# Altium project Module_FPGA_FreqDivider4Layers.PrjPcb
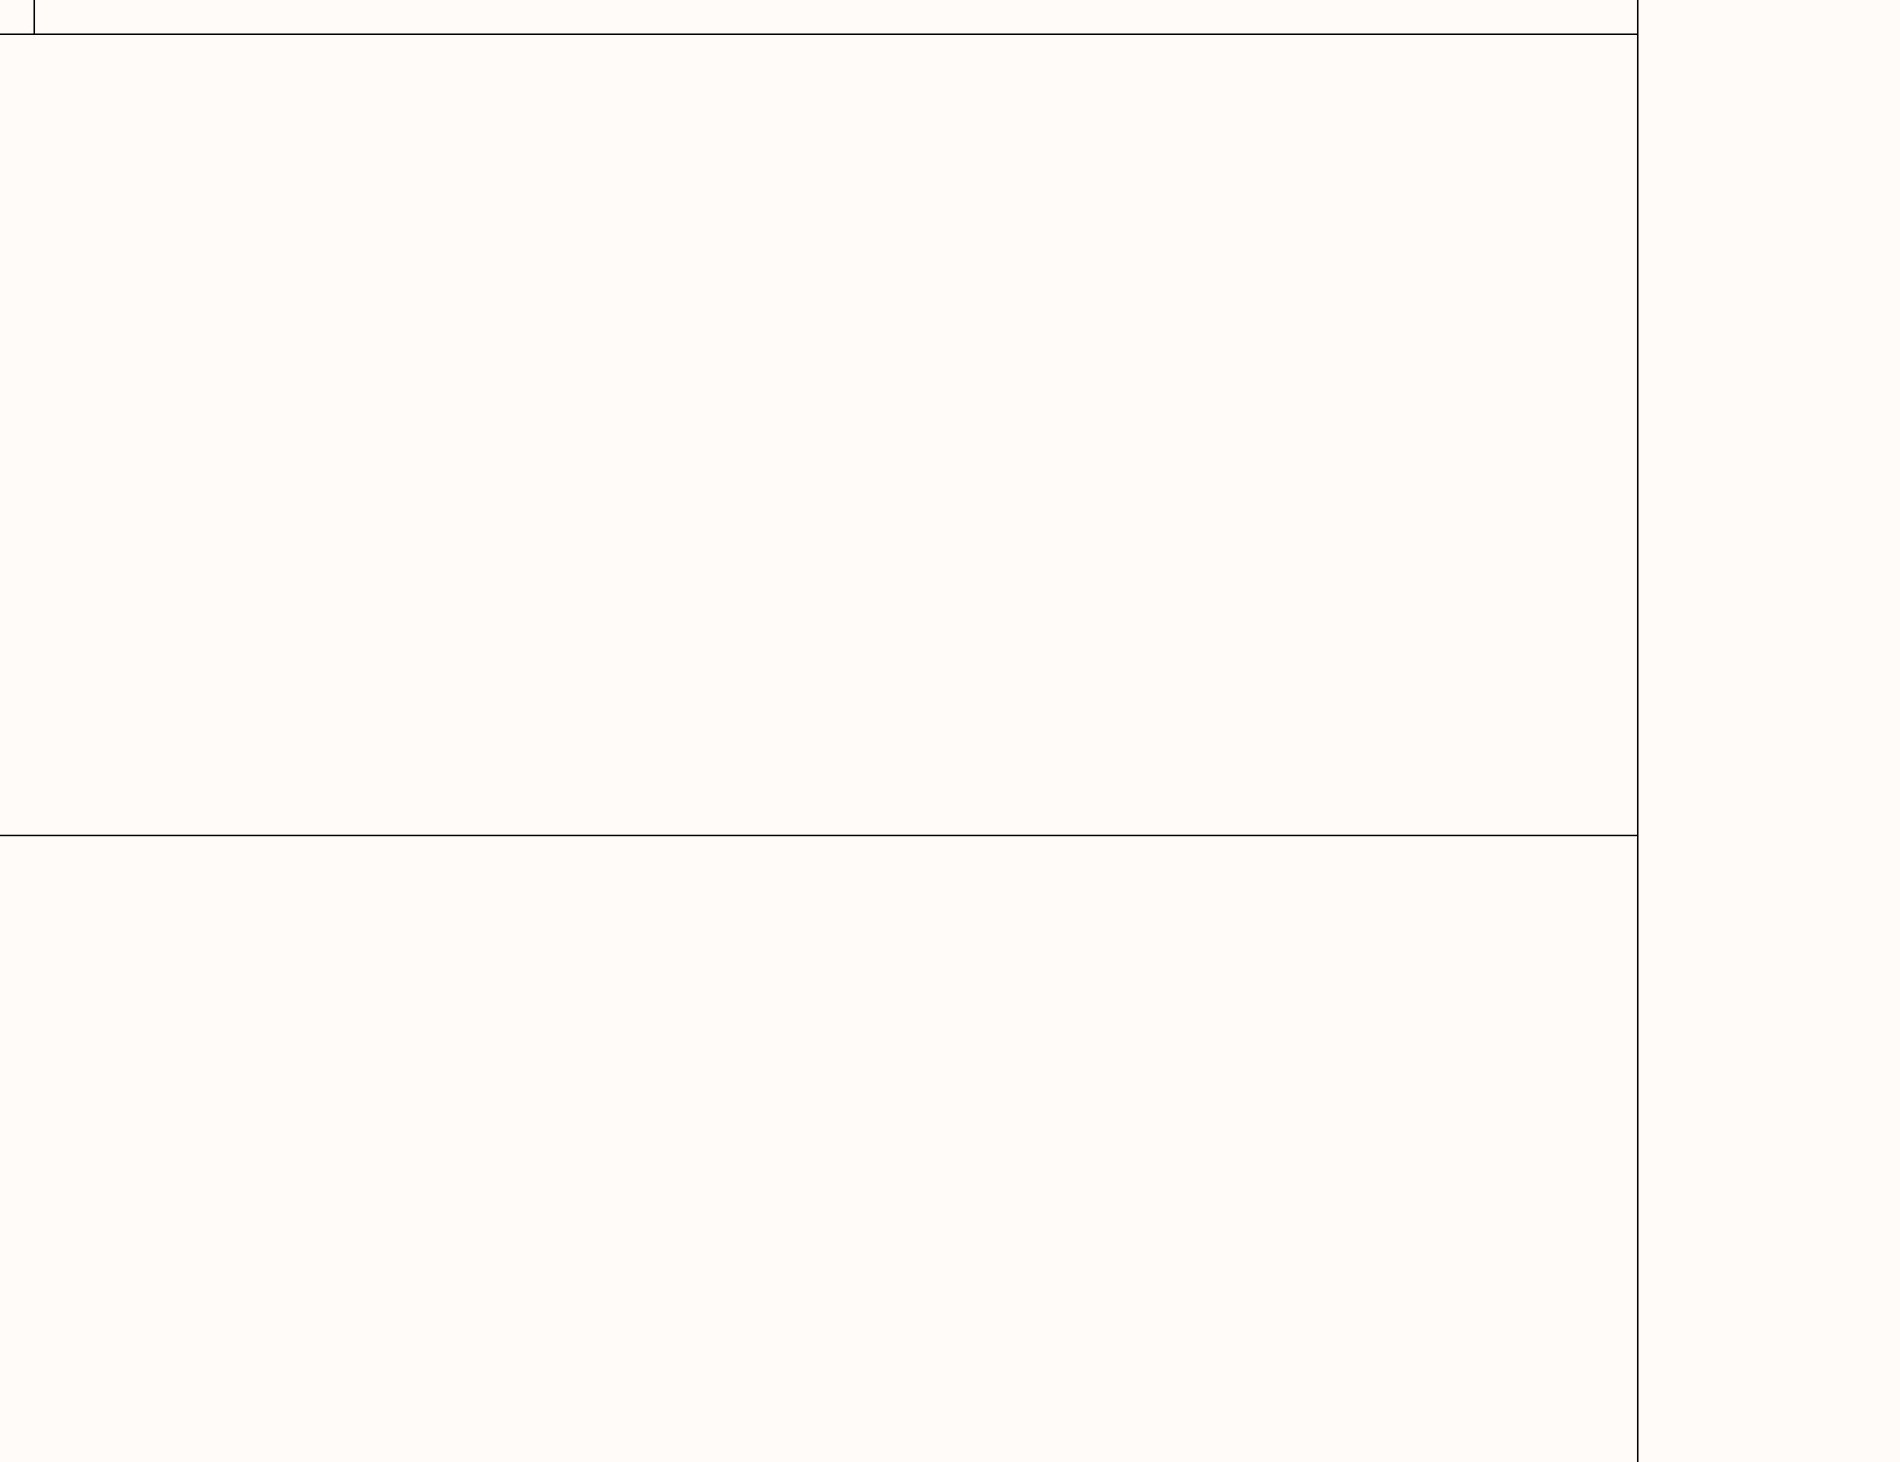
[diagram p0: Synthesizer.SchDoc, top column 1 of 4]
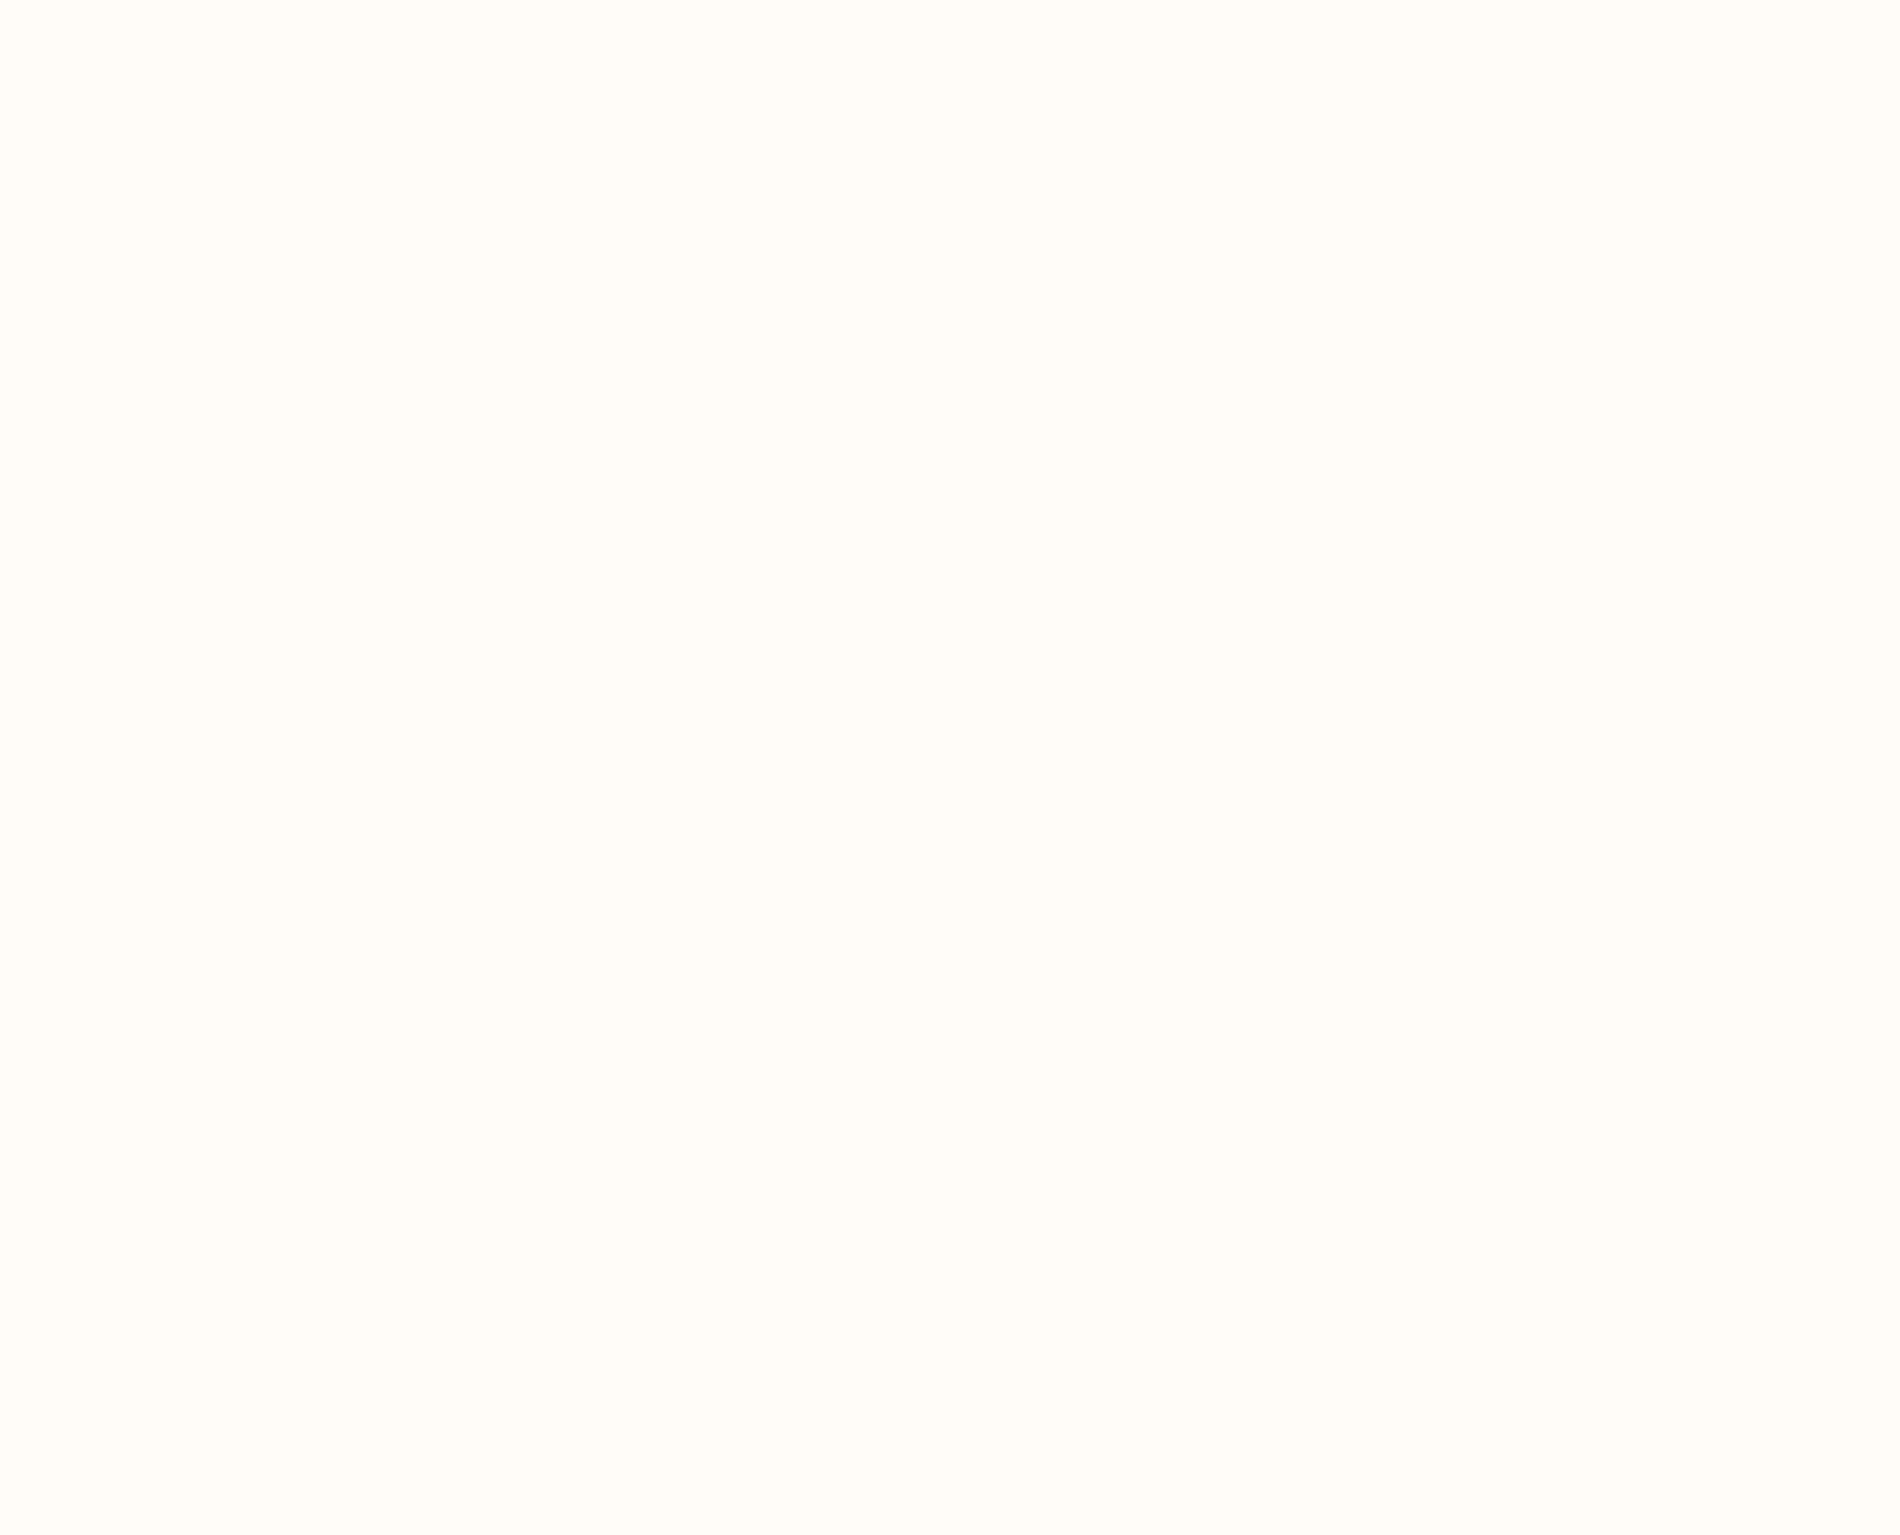
[diagram p1: Synthesizer.SchDoc, top column 2 of 4]
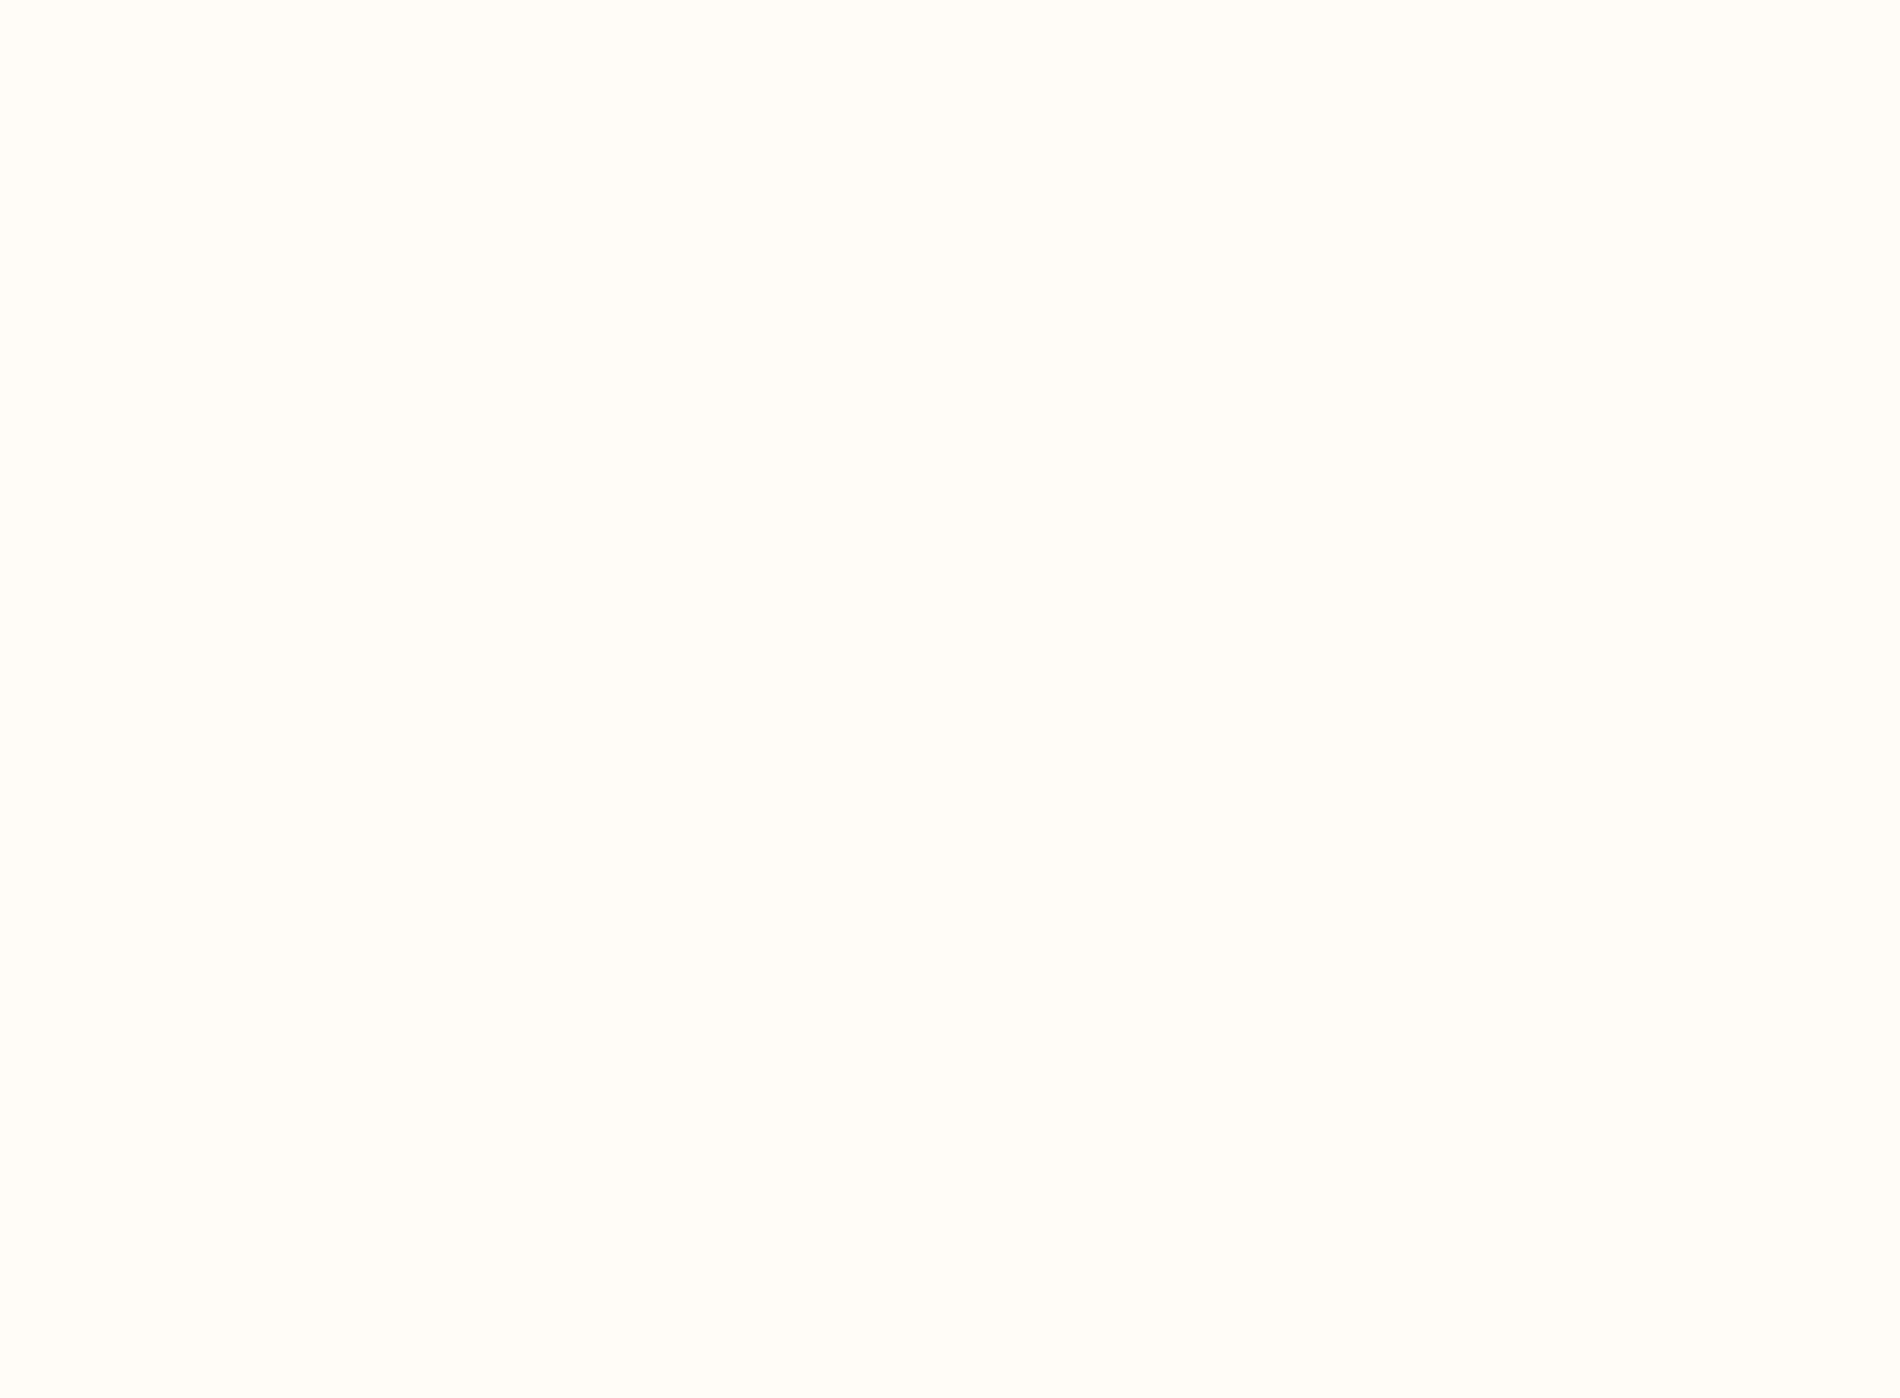
[diagram p2: Synthesizer.SchDoc, top column 3 of 4]
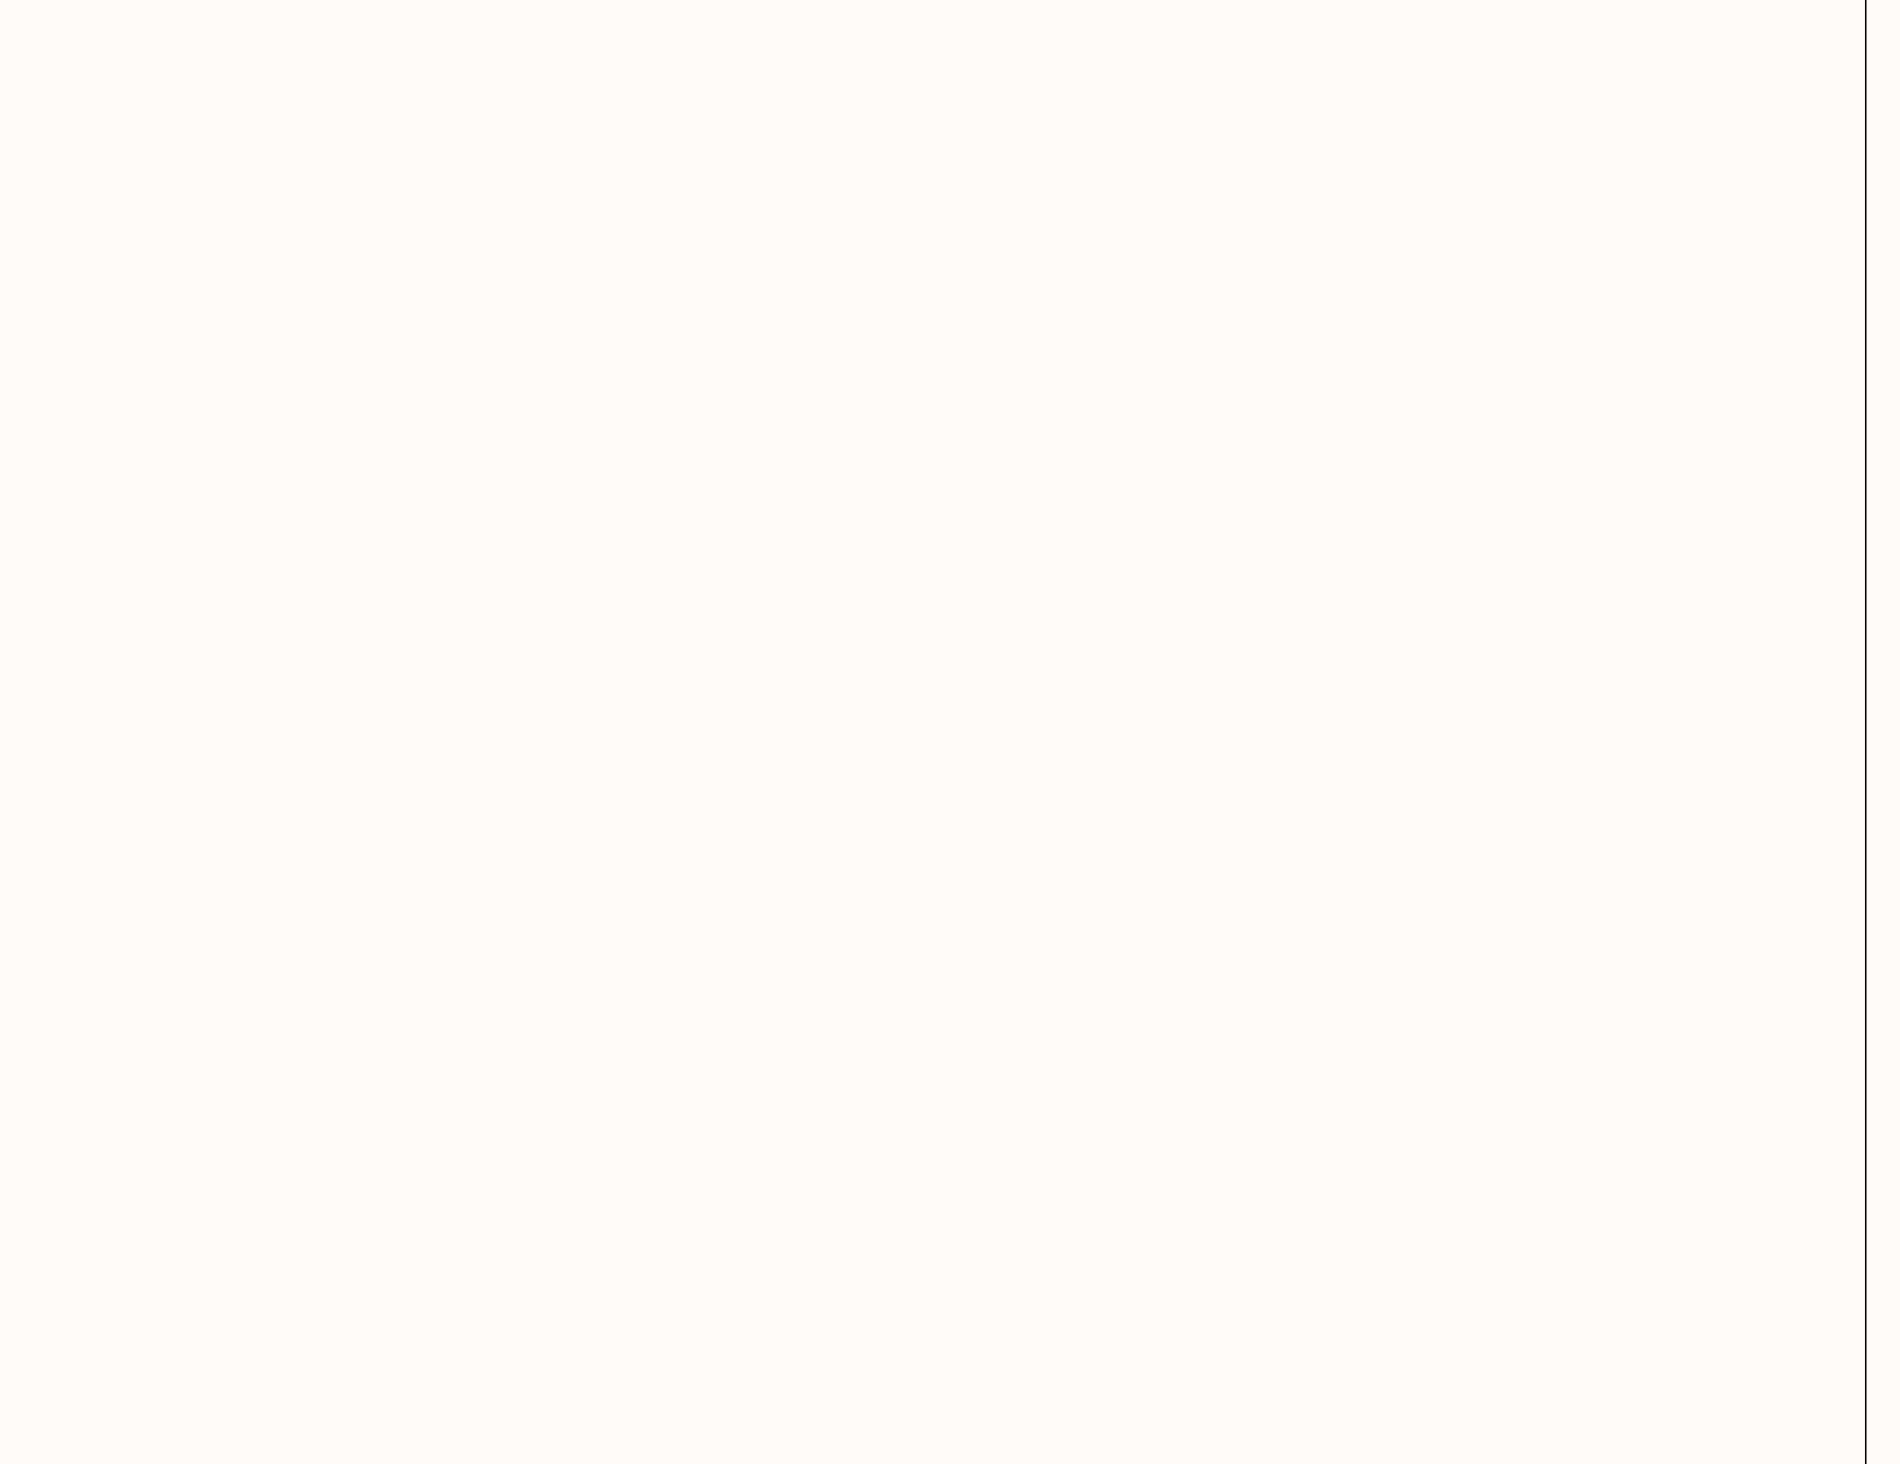
[diagram p3: Synthesizer.SchDoc, top column 4 of 4]
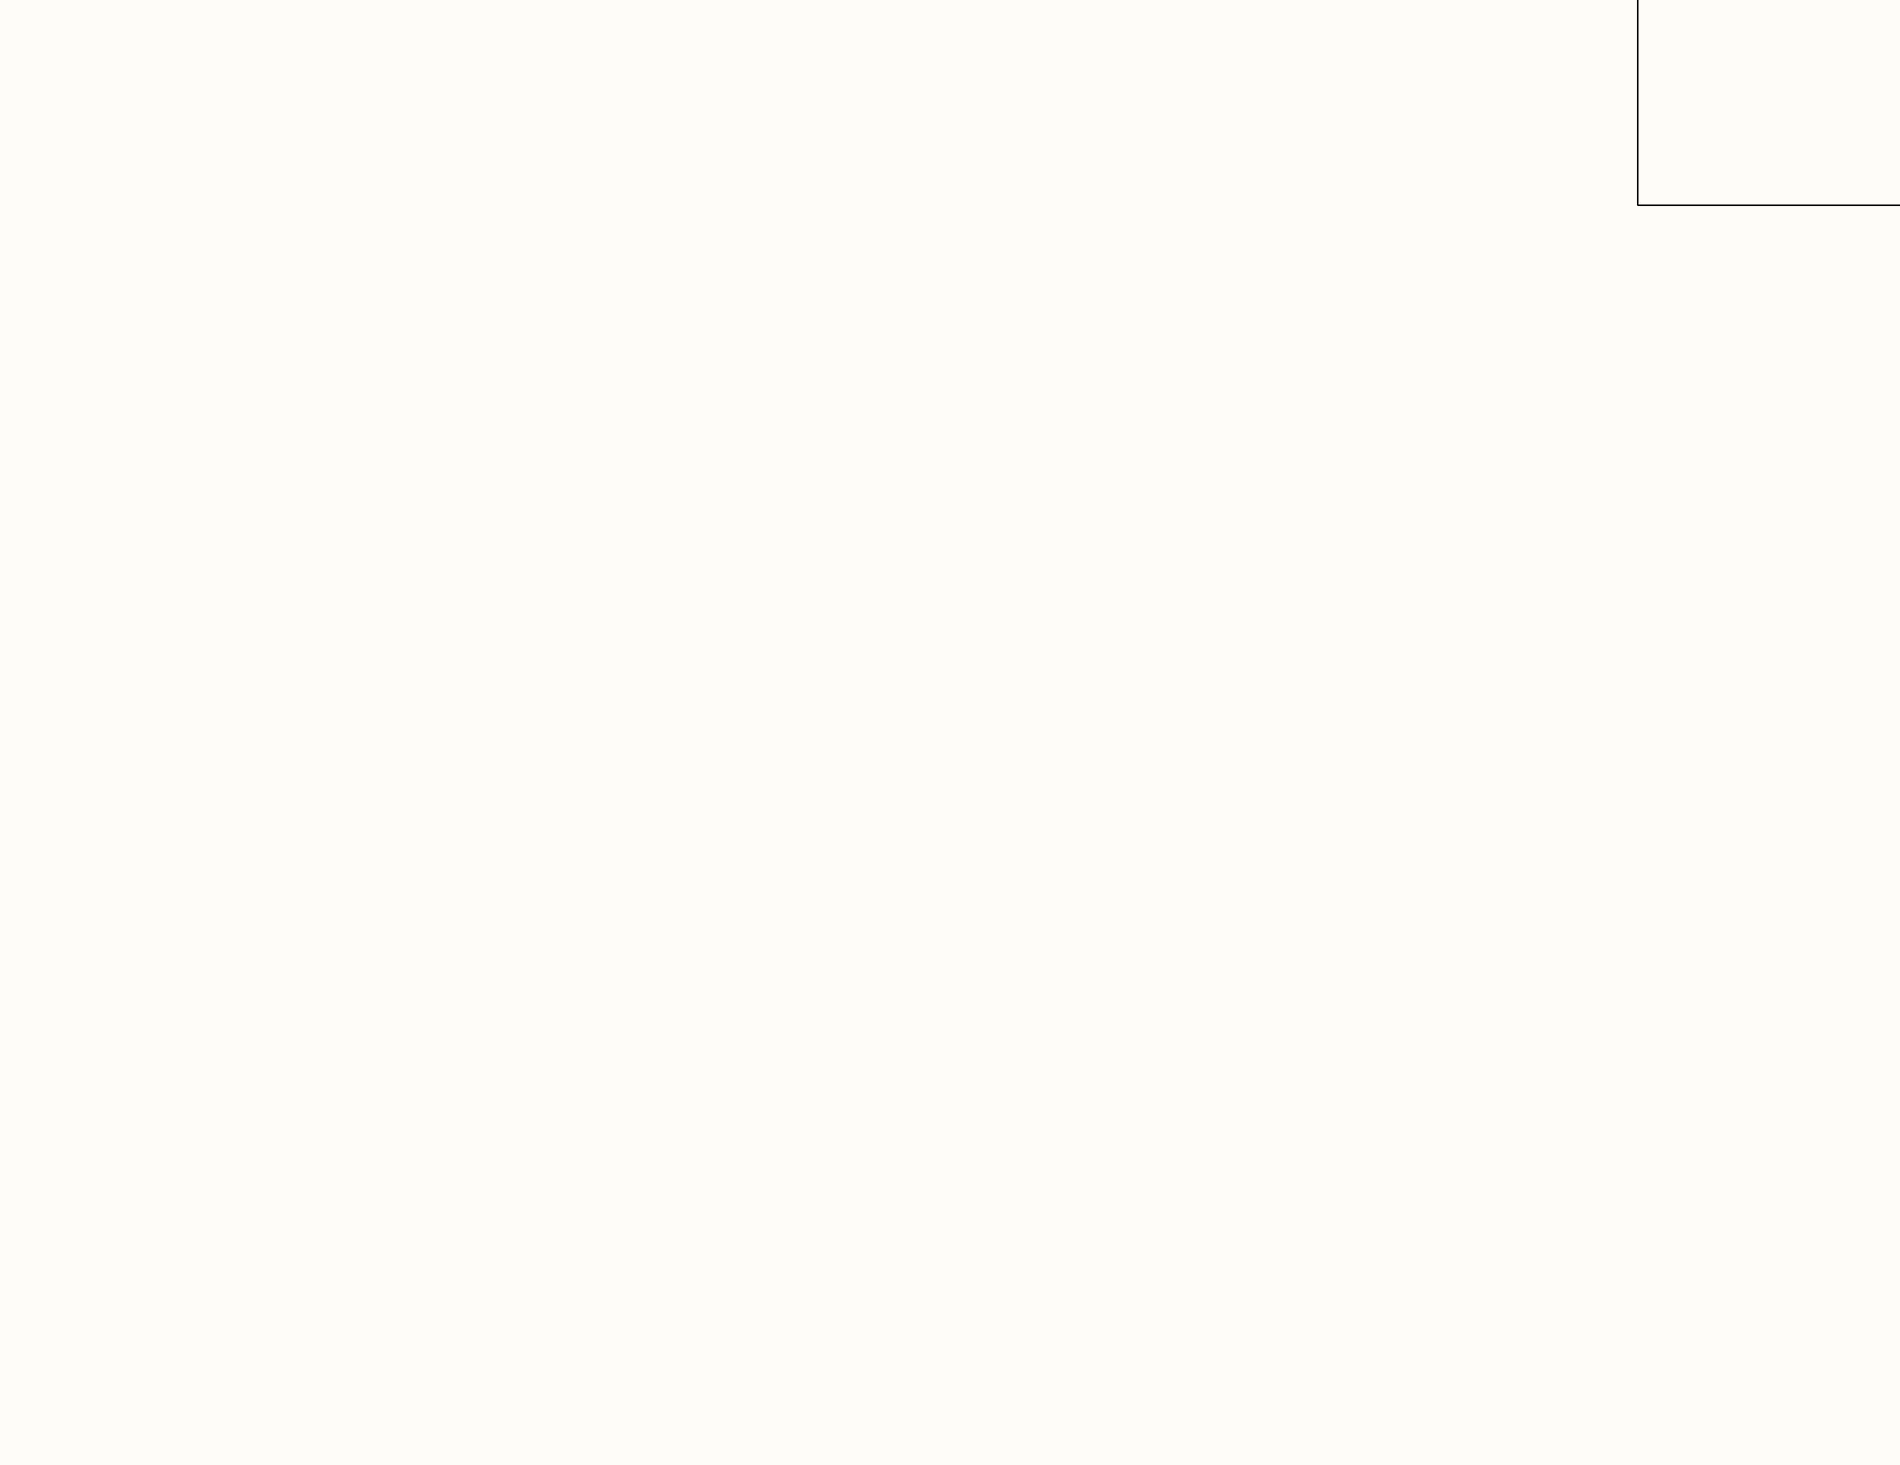
[diagram p4: Synthesizer.SchDoc, centre column 1 of 4]
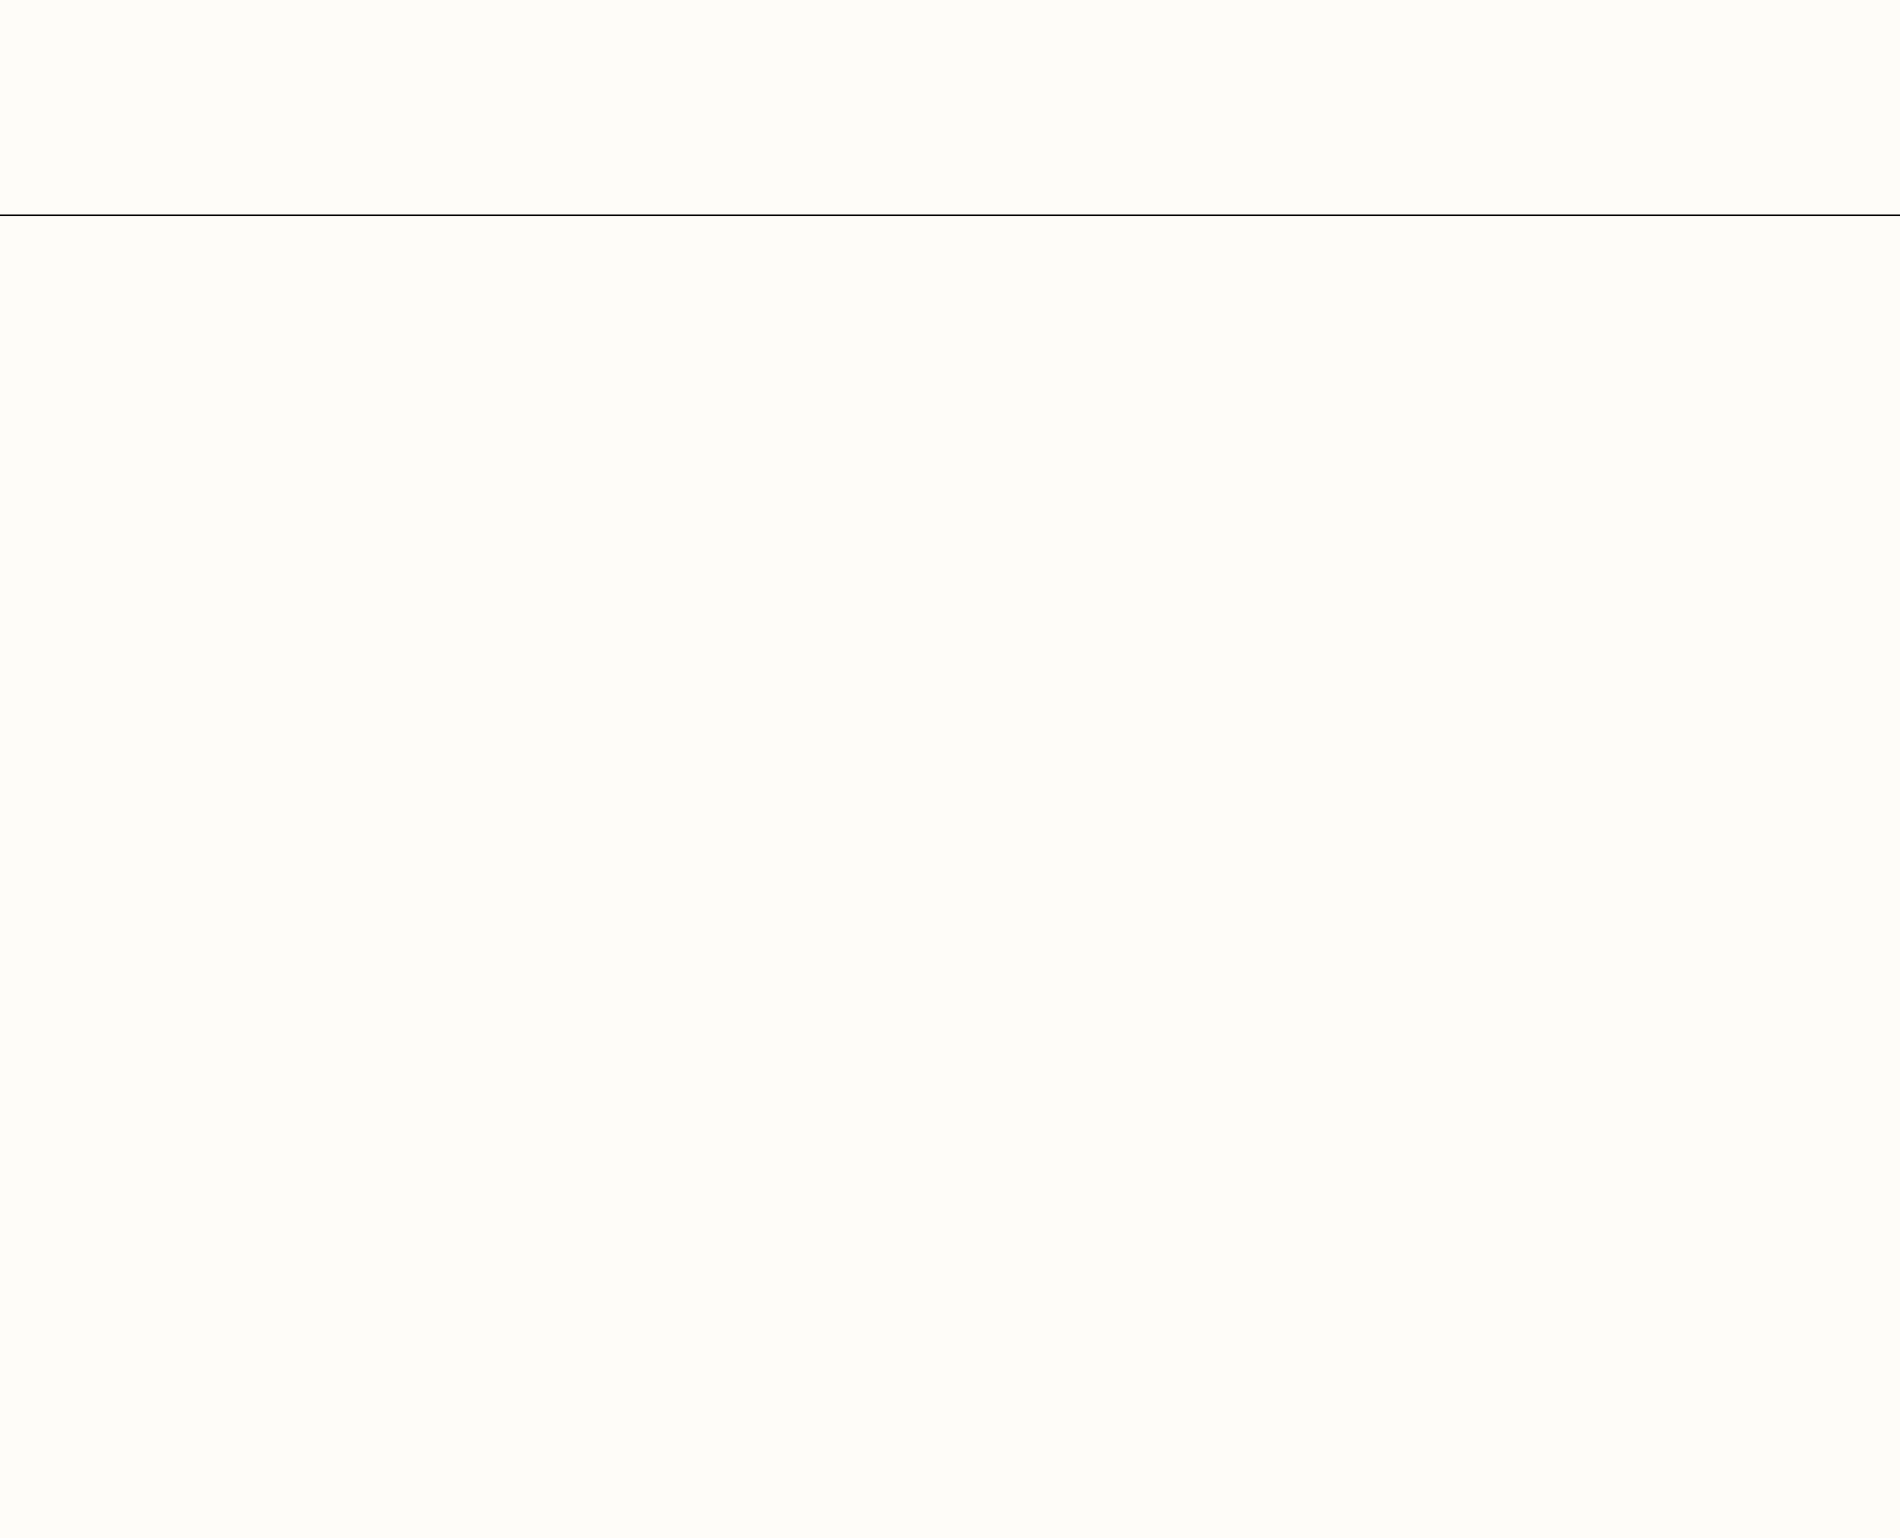
[diagram p5: Synthesizer.SchDoc, centre column 2 of 4]
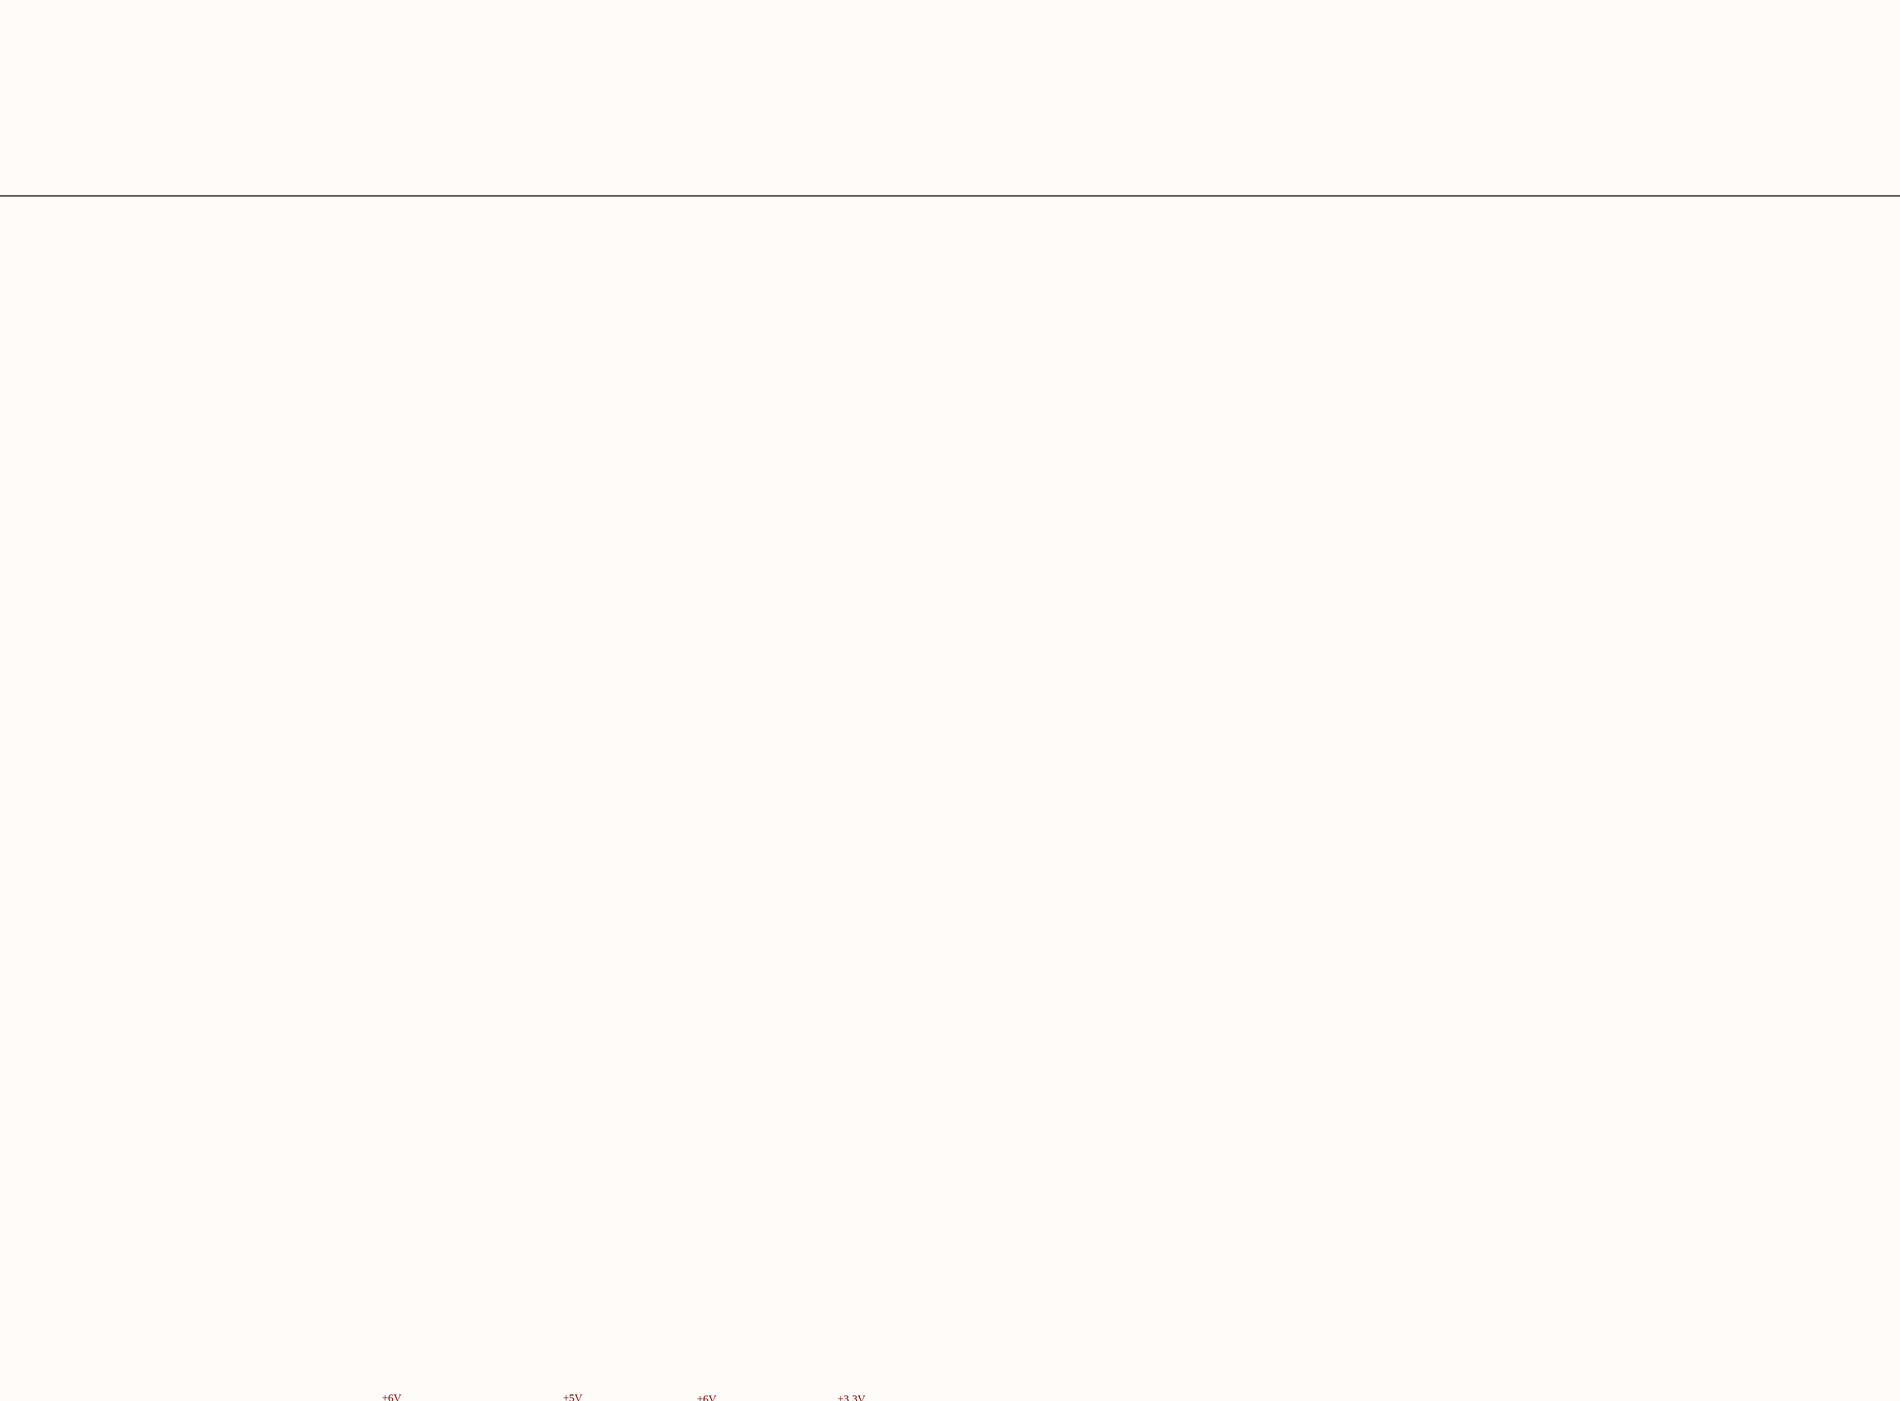
[diagram p6: Synthesizer.SchDoc, centre column 3 of 4]
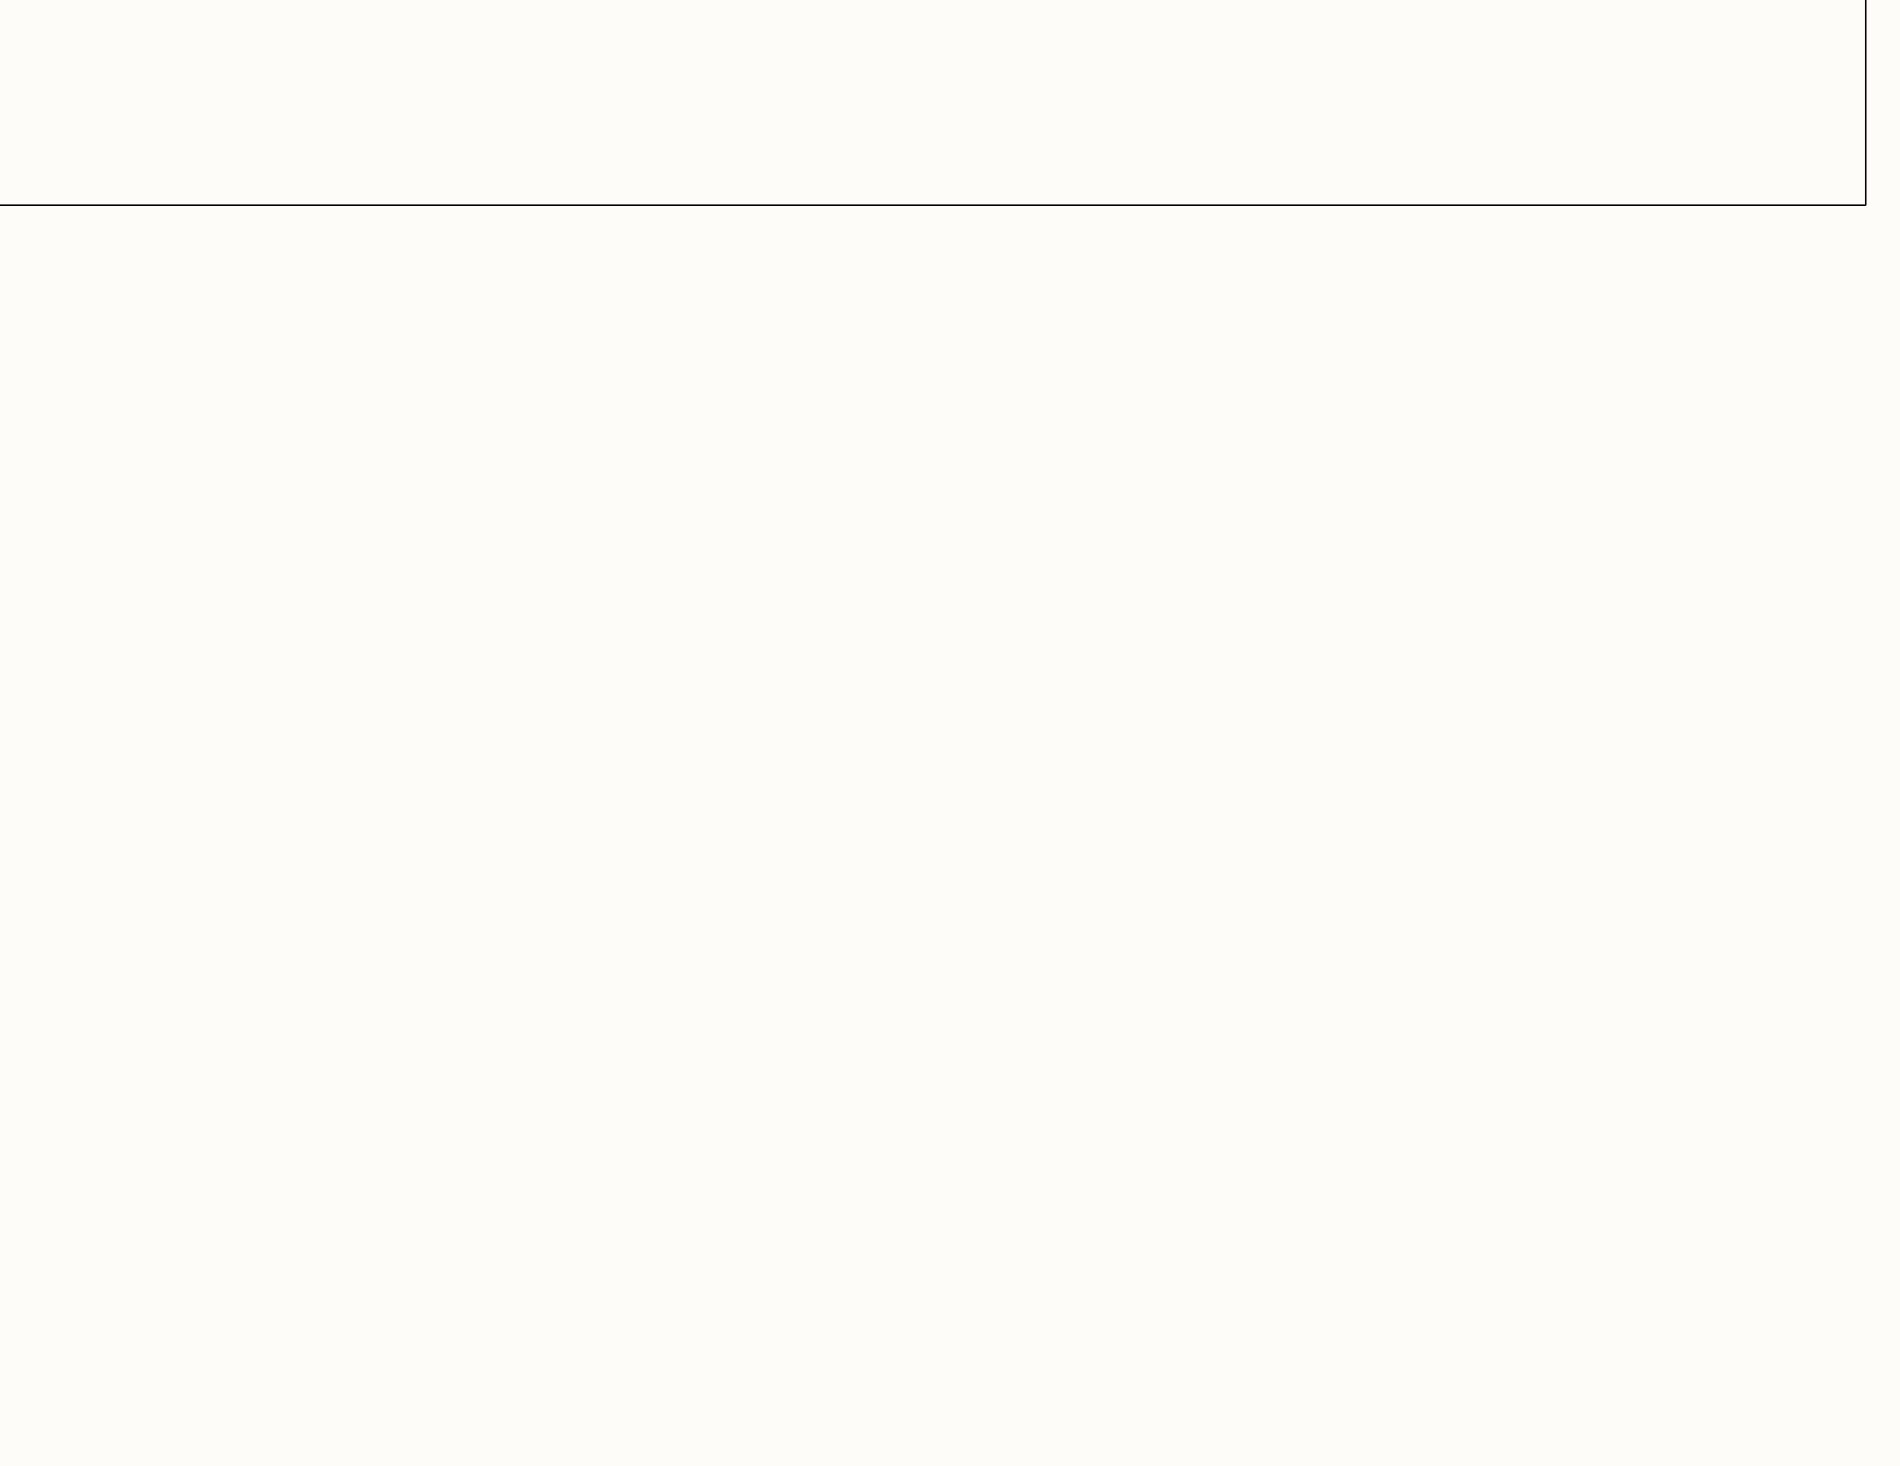
[diagram p7: Synthesizer.SchDoc, centre column 4 of 4]
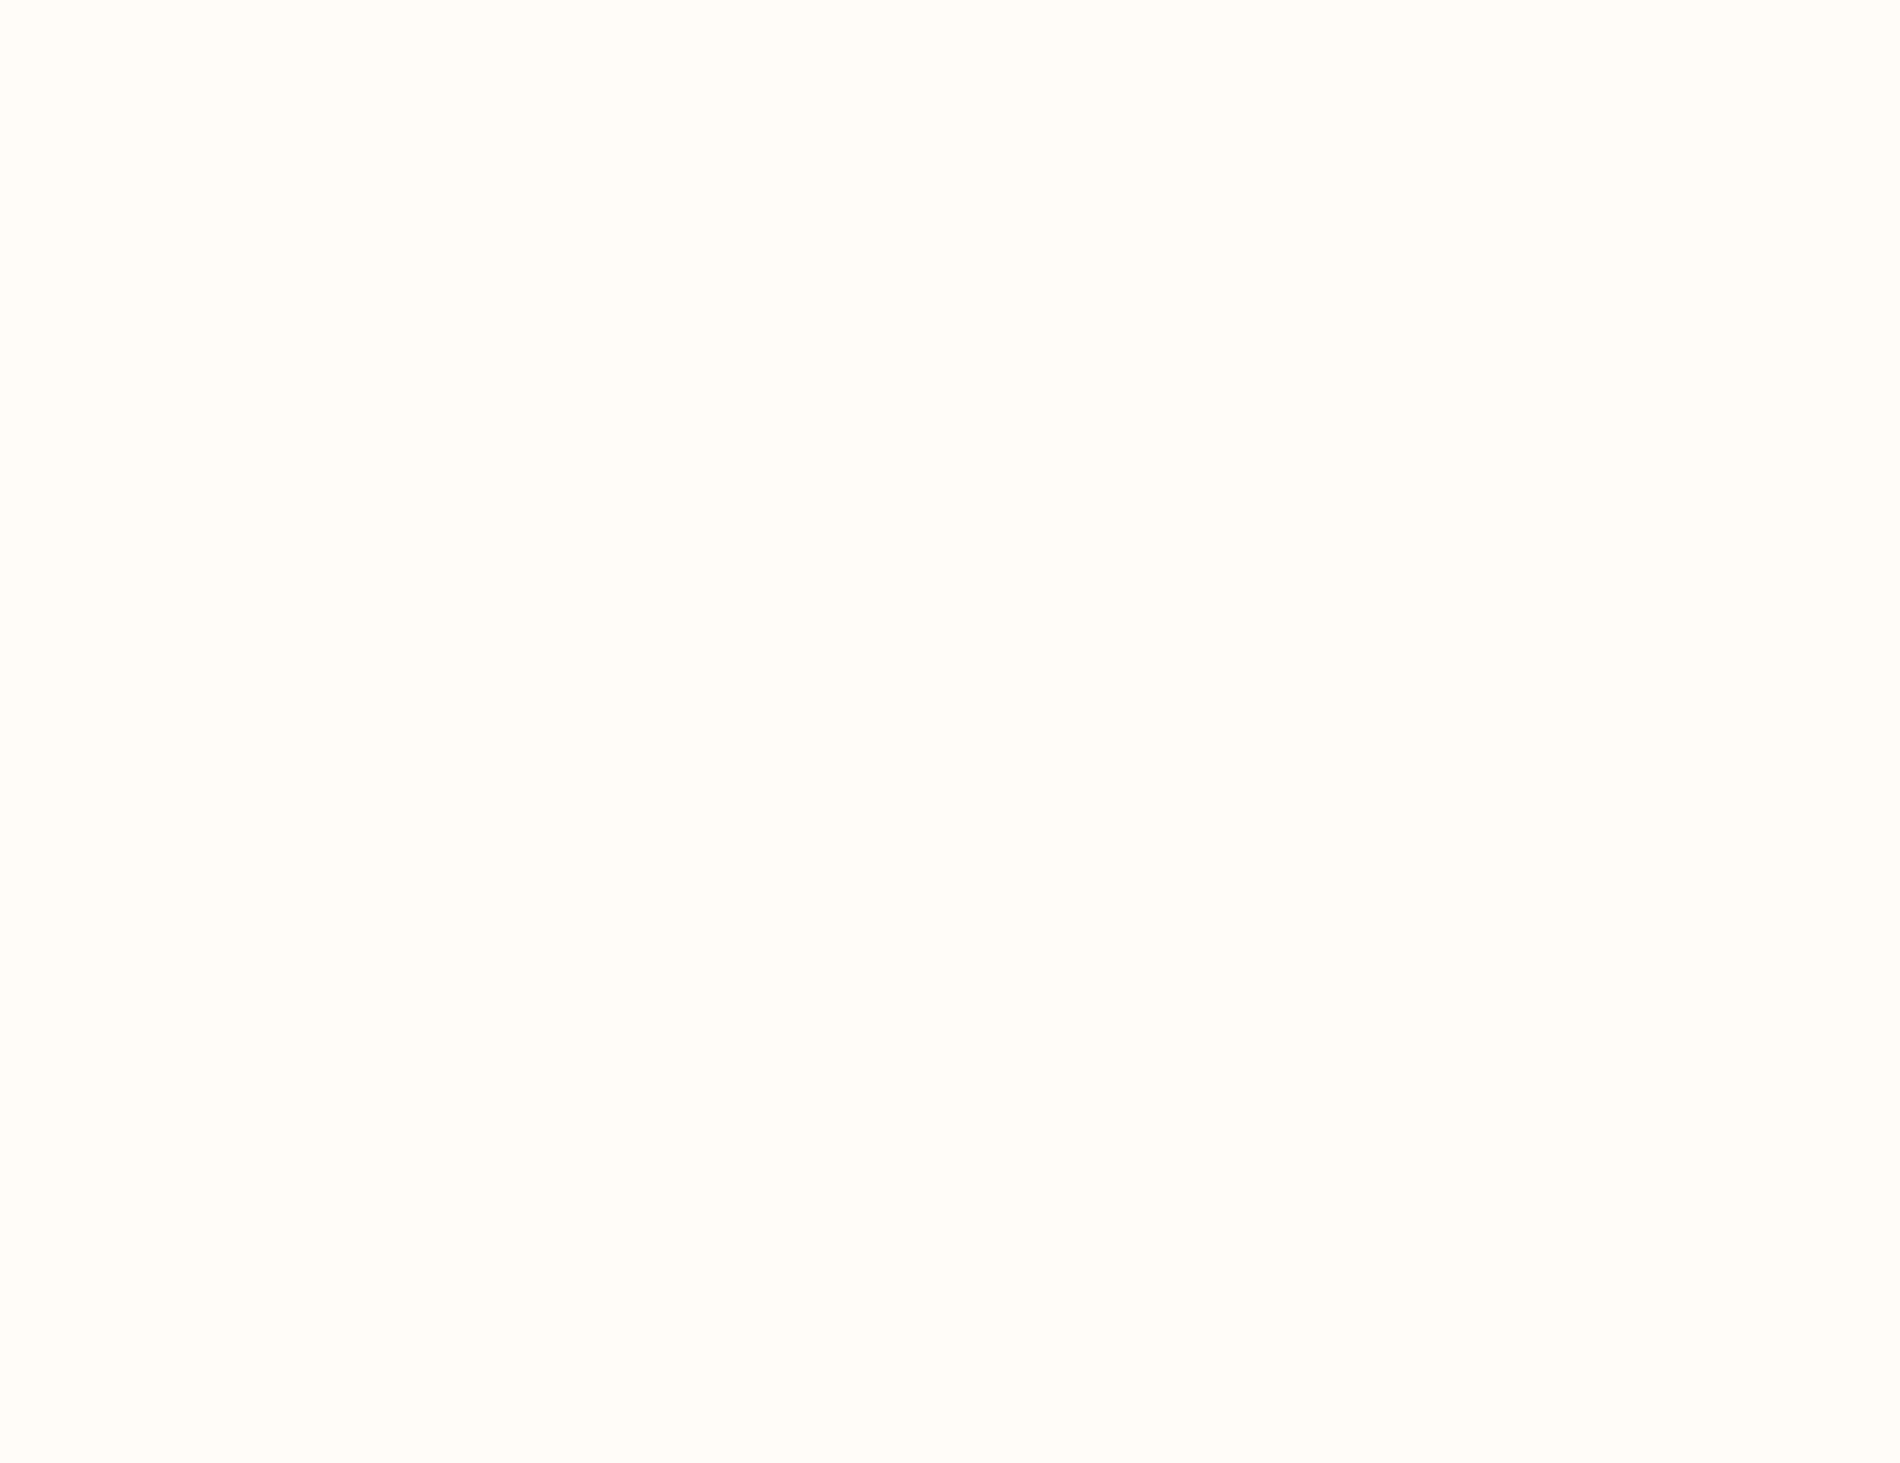
[diagram p8: Synthesizer.SchDoc, bottom column 1 of 4]
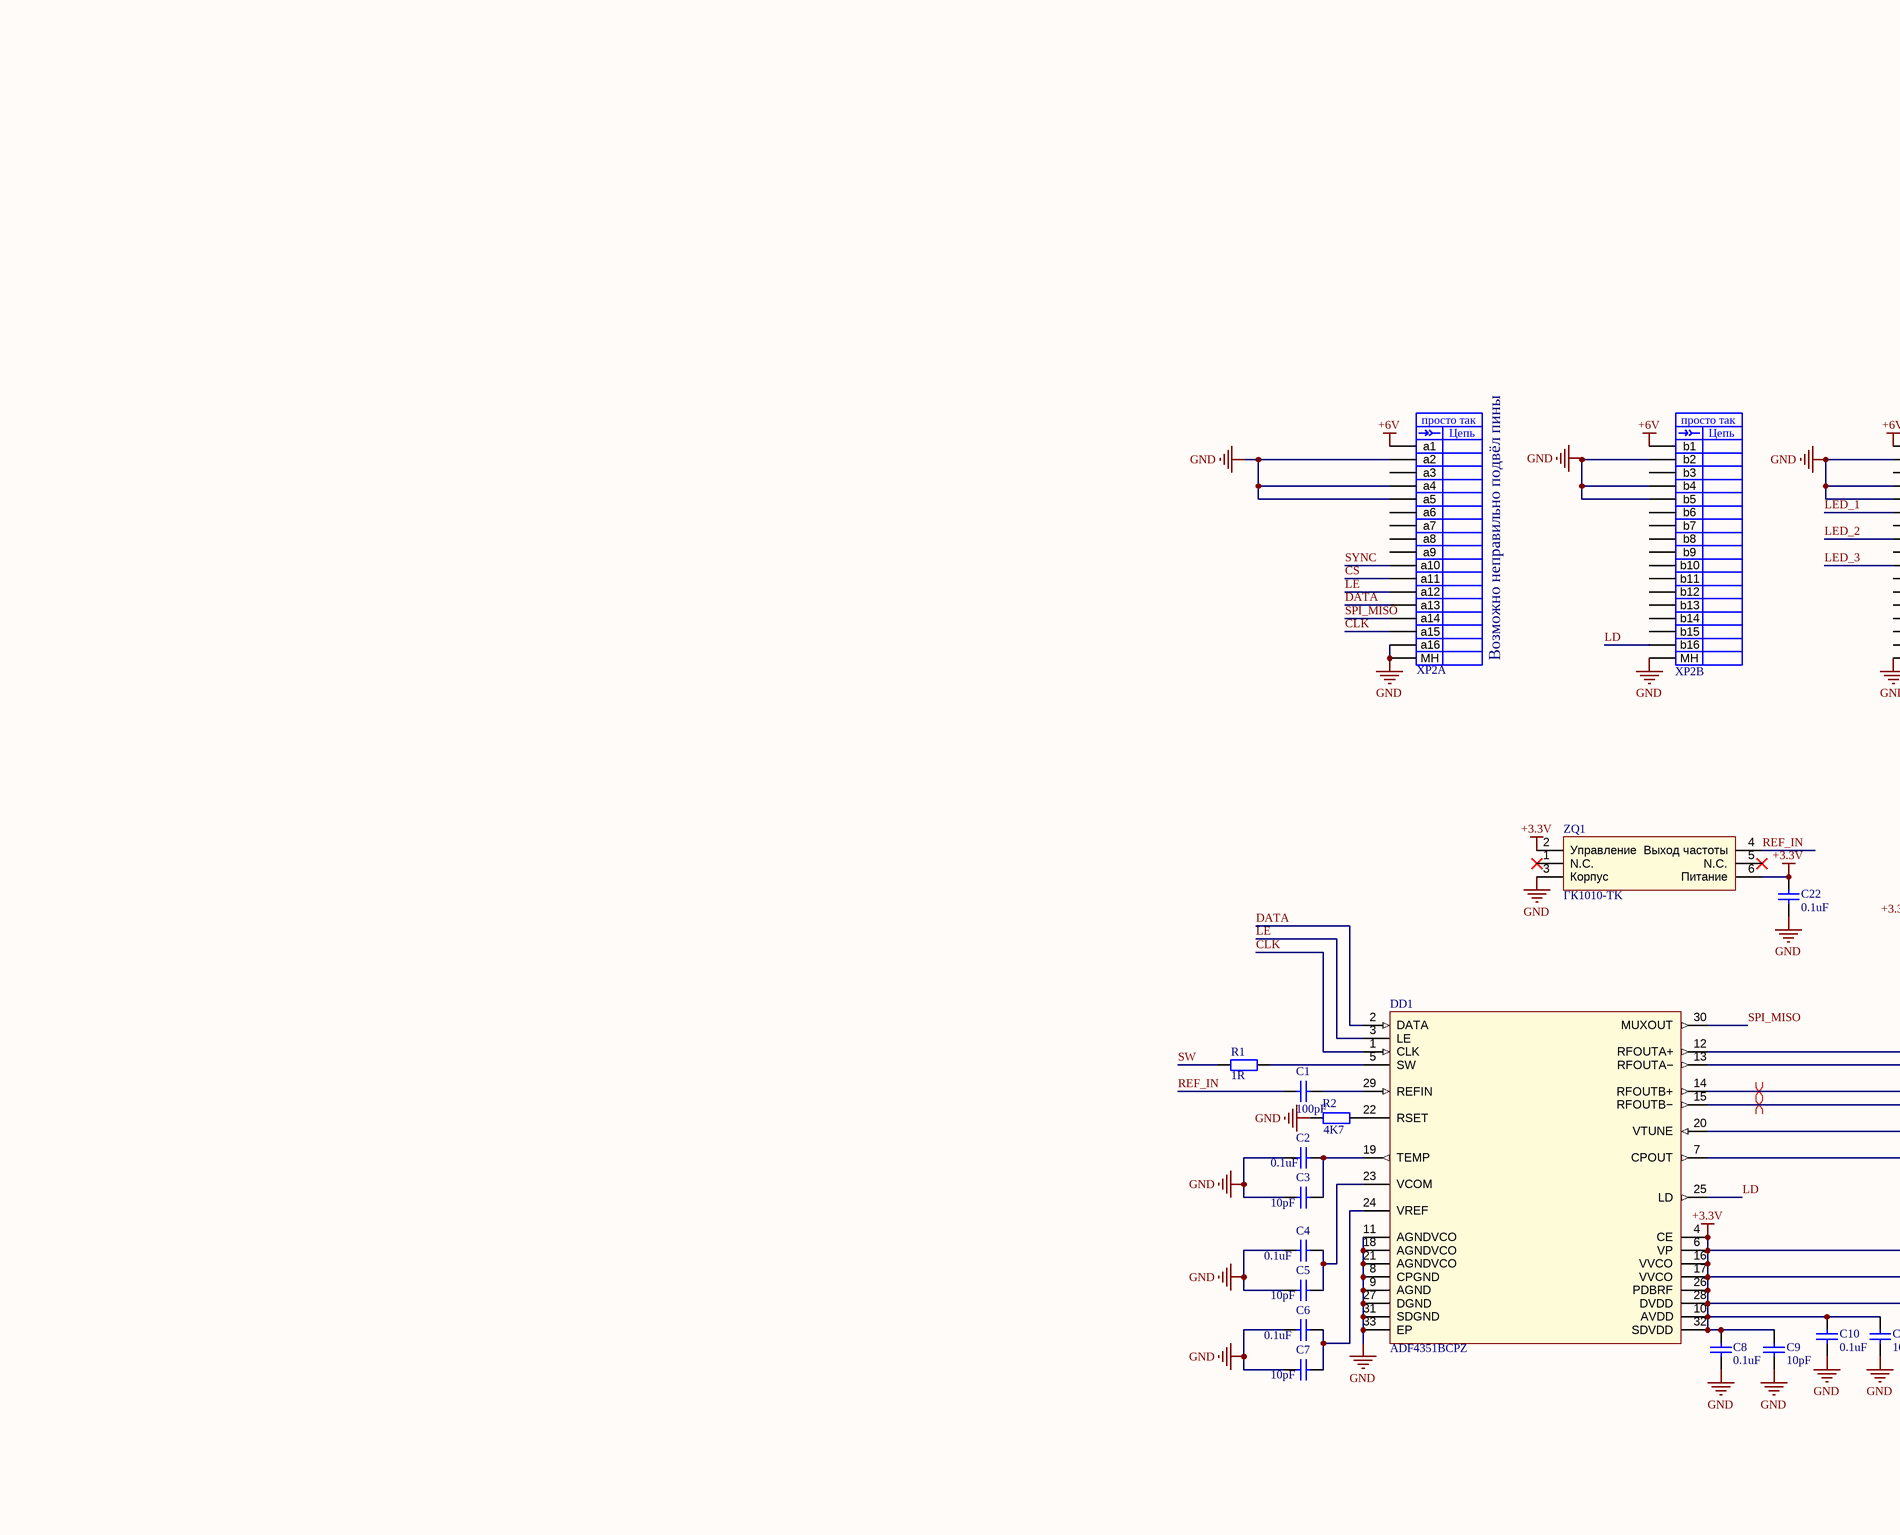
[diagram p9: Synthesizer.SchDoc, bottom column 2 of 4]
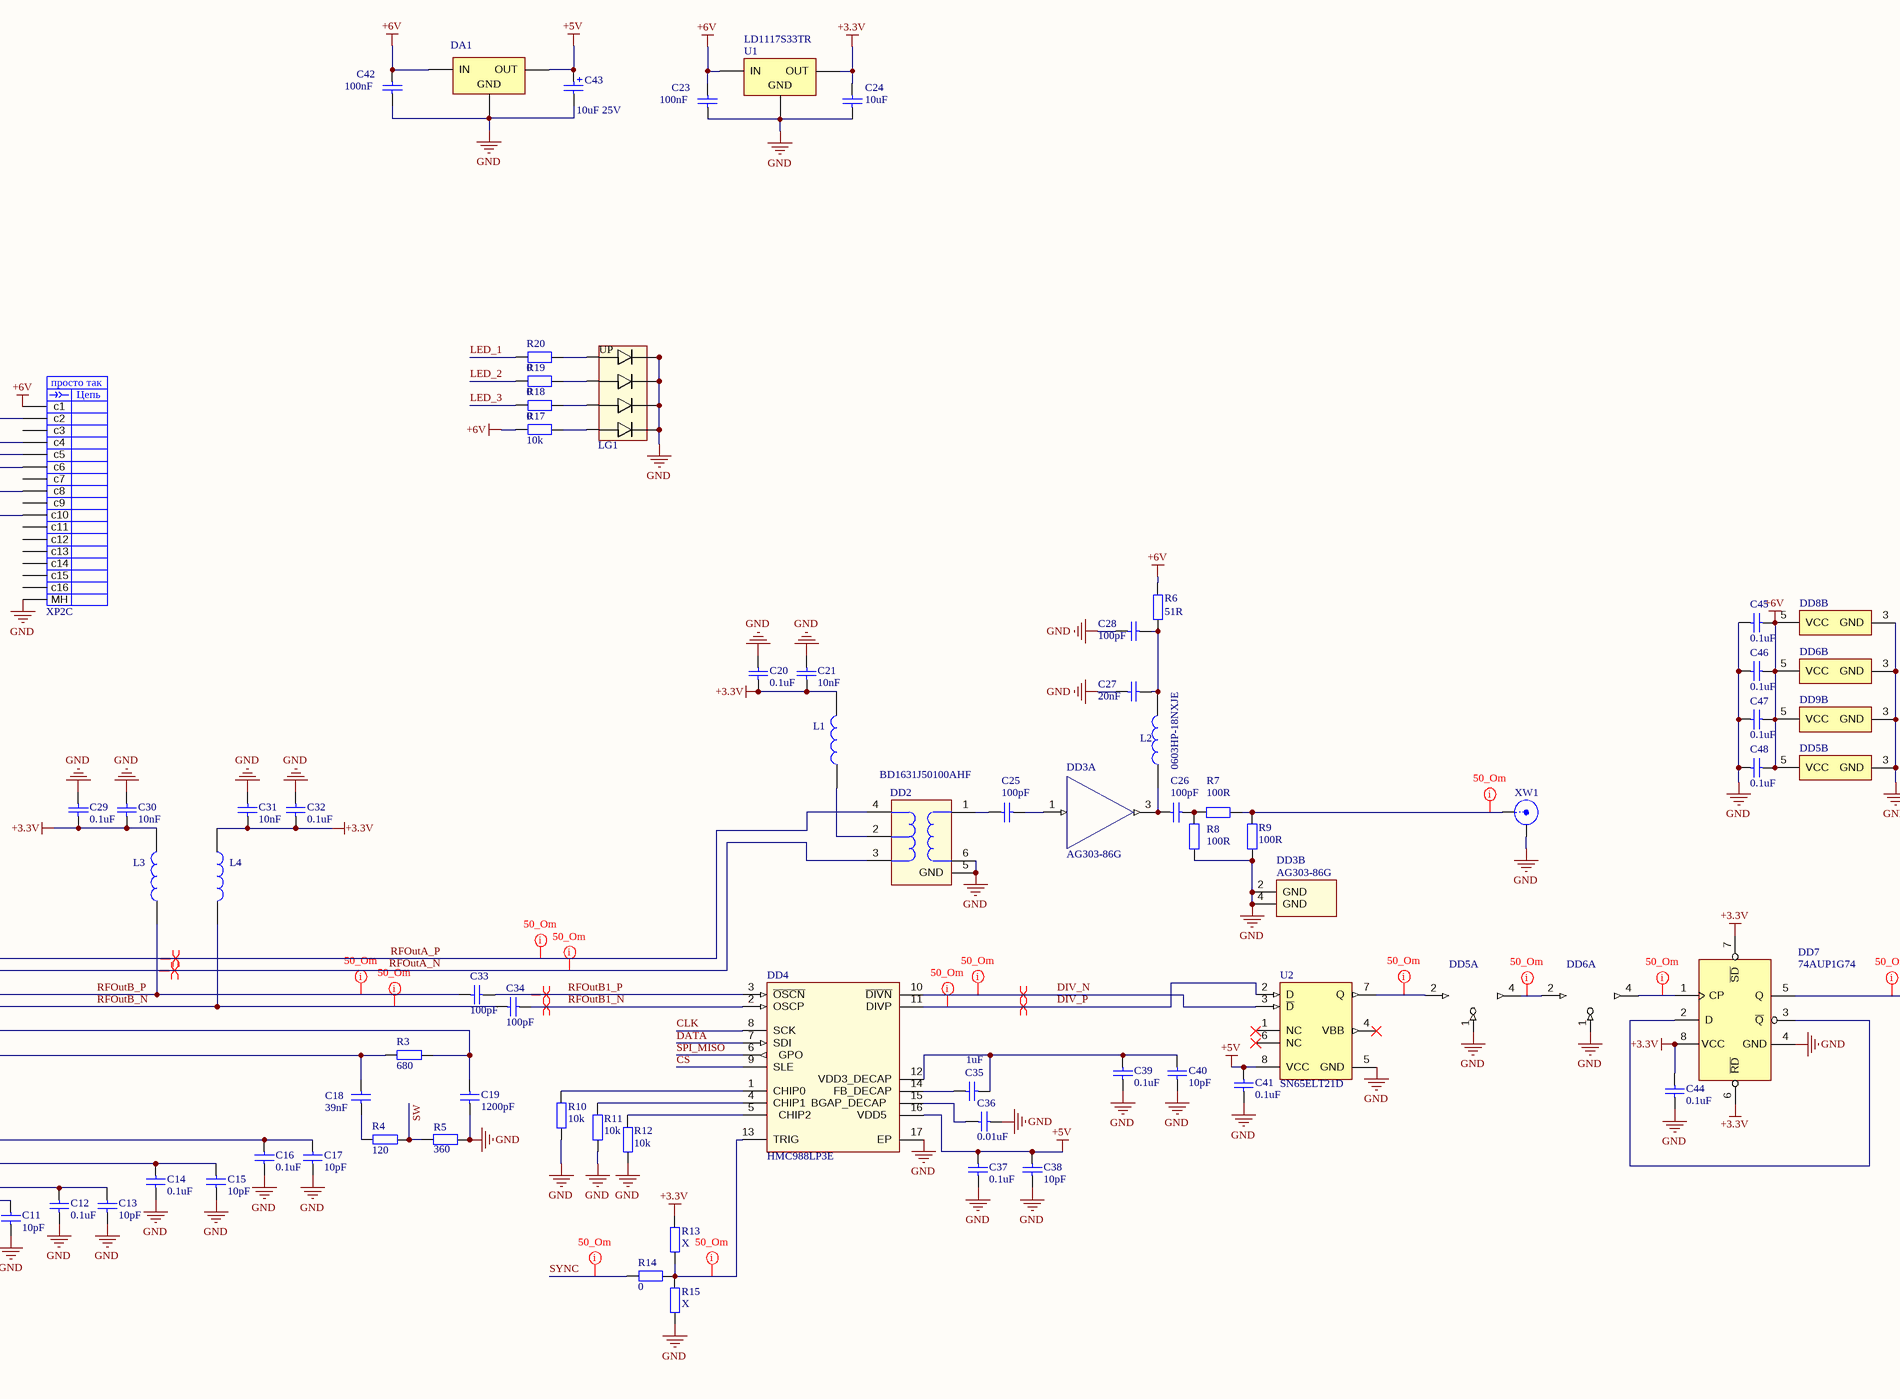
[diagram p10: Synthesizer.SchDoc, bottom column 3 of 4]
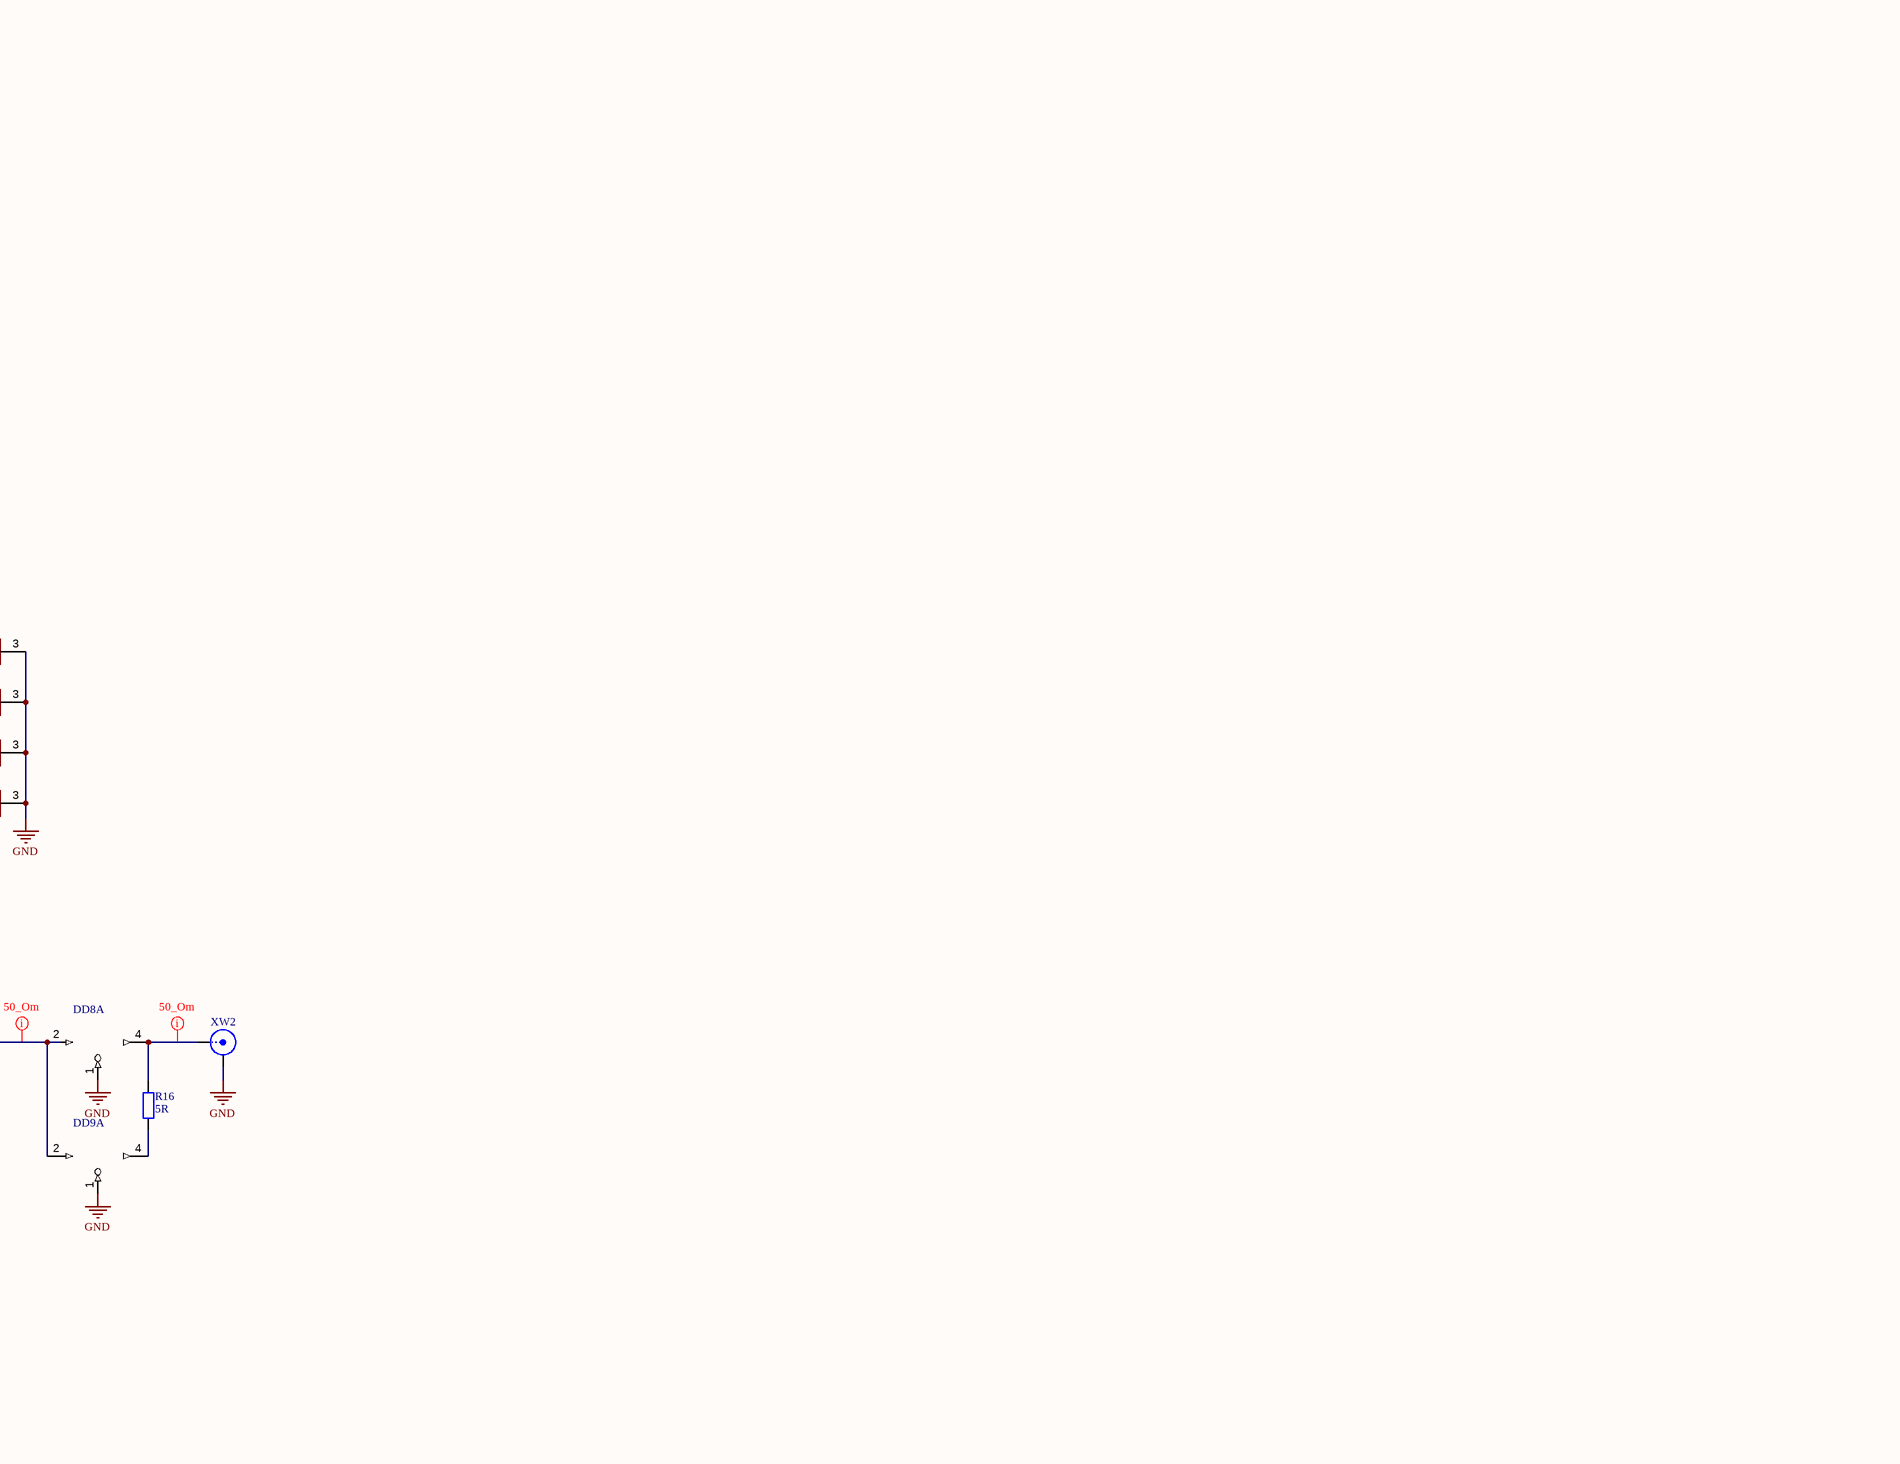
[diagram p11: Synthesizer.SchDoc, bottom column 4 of 4]
1 sheet, 89 parts. Net scope: global (net labels, ports and power ports of the same name join across sheets).
Board file: Synthesizer.PcbDoc

## Sheet Synthesizer.SchDoc
size 594 x 420 mm; SheetNumber: 1; SheetTotal: 1; SPICEModelCacheUTUGZQBW: <root> / <DocumentId>UTUGZQBW</DocumentId> / </root>

### Parts
C1  value 100pF  [SMD 0402 (1005) max]  (hidden comment: Capacitors)
C2  value 0.1uF  [SMD 0603 (1608) min]  (hidden comment: Capacitors)
C3  value 10pF  [SMD 0603 (1608) min]  (hidden comment: Capacitors)
C4  value 0.1uF  [SMD 0603 (1608) min]  (hidden comment: Capacitors)
C5  value 10pF  [SMD 0603 (1608) min]  (hidden comment: Capacitors)
C6  value 0.1uF  [SMD 0603 (1608) min]  (hidden comment: Capacitors)
C7  value 10pF  [SMD 0603 (1608) min]  (hidden comment: Capacitors)
C8  value 0.1uF  [SMD 0603 (1608) min]  (hidden comment: Capacitors)
C9  value 10pF  [SMD 0603 (1608) min]  (hidden comment: Capacitors)
C10  value 0.1uF  [SMD 0603 (1608) min]  (hidden comment: Capacitors)
C11  value 10pF  [SMD 0603 (1608) min]  (hidden comment: Capacitors)
C12  value 0.1uF  [SMD 0603 (1608) min]  (hidden comment: Capacitors)
C13  value 10pF  [SMD 0603 (1608) min]  (hidden comment: Capacitors)
C14  value 0.1uF  [SMD 0603 (1608) min]  (hidden comment: Capacitors)
C15  value 10pF  [SMD 0603 (1608) min]  (hidden comment: Capacitors)
C16  value 0.1uF  [SMD 0603 (1608) min]  (hidden comment: Capacitors)
C17  value 10pF  [SMD 0603 (1608) min]  (hidden comment: Capacitors)
C18  value 39nF  [SMD 0603 (1608) min]  (hidden comment: Capacitors)
C19  value 1200pF  [SMD 0603 (1608) min]  (hidden comment: Capacitors)
C20  value 0.1uF  [SMD 0603 (1608) min]  (hidden comment: Capacitors)
C21  value 10nF  [SMD 0603 (1608) min]  (hidden comment: Capacitors)
C22  value 0.1uF  [SMD 0603 (1608) min]  (hidden comment: Capacitors)
C23  value 100nF  [0805 (2012)]  (hidden comment: VJ0805Y104KXBTW1BC)
C24  value 10uF  [0805 (2012)]  (hidden comment: VJ0805V106ZXQTW1BC)
C25  value 100pF  [1414 (Min1)]  (hidden comment: 100A101JT150XT)
C26  value 100pF  [1414 (Min1)]  (hidden comment: 100A101JT150XT)
C27  value 20nF  [1414 (Min1)]  (hidden comment: 100A101JT150XT)
C28  value 100pF  [0603 (1608)]  (hidden comment: VJ0603Y104KXAAC)
C29  value 0.1uF  [SMD 0603 (1608) min]  (hidden comment: Capacitors)
C30  value 10nF  [SMD 0603 (1608) min]  (hidden comment: Capacitors)
C31  value 10nF  [SMD 0603 (1608) min]  (hidden comment: Capacitors)
C32  value 0.1uF  [SMD 0603 (1608) min]  (hidden comment: Capacitors)
C33  value 100pF  [SMD 0402 (1005) max]  (hidden comment: Capacitors)
C34  value 100pF  [SMD 0402 (1005) max]  (hidden comment: Capacitors)
C35  value 1uF  [SMD 0603 (1608) min]  (hidden comment: Capacitors)
C36  value 0.01uF  [SMD 0603 (1608) min]  (hidden comment: Capacitors)
C37  value 0.1uF  [SMD 0603 (1608) min]  (hidden comment: Capacitors)
C38  value 10pF  [SMD 0603 (1608) min]  (hidden comment: Capacitors)
C39  value 0.1uF  [SMD 0603 (1608) min]  (hidden comment: Capacitors)
C40  value 10pF  [SMD 0603 (1608) min]  (hidden comment: Capacitors)
C41  value 0.1uF  [SMD 0603 (1608) min]  (hidden comment: Capacitors)
C42  value 100nF  [0805 (2012)]  (hidden comment: VJ0805Y104KXBTW1BC)
C43  value 10uF 25V  [Electrolytic D=8mm H=11.5mm]  (hidden comment: Capacitor Polarized)
C44  value 0.1uF  [SMD 0603 (1608) min]  (hidden comment: Capacitors)
C45  value 0.1uF  [SMD 0603 (1608) min]  (hidden comment: Capacitors)
C46  value 0.1uF  [SMD 0603 (1608) min]  (hidden comment: Capacitors)
C47  value 0.1uF  [SMD 0603 (1608) min]  (hidden comment: Capacitors)
C48  value 0.1uF  [SMD 0603 (1608) min]  (hidden comment: Capacitors)
DA1  LF50ABDT-TR  [DPAK228P970X238-3N]  (value not drawn)
DD1  ADF4351BCPZ  [LFCSP-32  Long Pin - with VIA]
DD2  BD1631J50100AHF  [0805_a]
DD3  AG303-86G  [SOT-86 (Min)]  (parts A,B of 2)
DD4  HMC988LP3E  [QFN16M.5 Long Pin]
DD5  SN74AHCT1G125DBVR  [SOT-23-5]  (value not drawn)  (parts A,B of 2)
DD6  SN74AHCT1G125DBVR  [SOT-23-5]  (value not drawn)  (parts A,B of 2)
DD7  74AUP1G74  [SOT765-1]
DD8  SN74AHCT1G125DBVR  [SOT-23-5]  (value not drawn)  (parts A,B of 2)
DD9  SN74AHCT1G125DBVR  [SOT-23-5]  (value not drawn)  (parts A,B of 2)
L1  0603HP-18NXJE  [0603HP]  (value not drawn)
L2  0603HP-18NXJE  [0603HP]
L3  0603HP-18NXJE  [0603HP]  (value not drawn)
L4  0603HP-18NXJE  [0603HP]  (value not drawn)
LG1  1296.1004  [1296.1004]  (value not drawn)
R1  value 1R  [Resistor SMD 0603 (1608) min]  (hidden comment: Resistor)
R2  4K7  [0603R-4K7]
R3  680  [0603R-4K7]
R4  120  [0603R-4K7]
R5  value 360  [Resistor SMD 0603 (1608) min]  (hidden comment: Resistor)
R6  51R  [0603R-100]
R7  100R  [0603R-100]
R8  100R  [0603R-100]
R9  100R  [0603R-100]
R10  10k  [0603R-0R]
R11  10k  [0603R-0R]
R12  10k  [0603R-0R]
R13  X  [0603R-0R]
R14  0  [0603R-0R]
R15  X  [0603R-0R]
R16  5R  [0603R-0R]
R17  10k  [0603R-0R]
R18  0  [0603R-0R]
R19  0  [0603R-0R]
R20  0  [0603R-0R]
U1  LD1117S33TR  [SOT-223]
U2  SN65ELT21D  [DGK8_L]
XP2  09 23 148 6921  [09 23 148 6921]  (value not drawn)  (parts A,B,C of 3)
XW1  J01151A0201  [J01151A0201]  (value not drawn)
XW2  J01151A0201  [J01151A0201]  (value not drawn)
ZQ1  ГК1010-TK  [DIL-8]

### Nets
+3.3V: C8.1 C9.2 C10.1 C11.2 C12.1 C13.2 C14.1 C15.2 C16.1 C17.2 C20.1 C21.2 C22.2 C24.2 C29.1 C30.2 C31.2 C32.1 C44.1 DD1.4(CE) DD1.6(VP) DD1.10(AVDD) DD1.16(VVCO) DD1.17(VVCO) DD1.26(PDBRF) DD1.28(DVDD) DD1.32(SDVDD) DD7.6(~{RD}) DD7.7(~{SD}) DD7.8(VCC) L1.2 L3.2 L4.2 R13.2 U1.2(OUT) ZQ1.2(Управление) ZQ1.6(Питание)
+5V: C37.2 C38.2 C41.2 C43.1 DA1.3(OUT) DD4.16(VDD5) U2.8(VCC)
+6V: C23.2 C42.2 C45.1 C46.1 C47.1 C48.1 DA1.1(IN) DD5.5(VCC) DD6.5(VCC) DD8.5(VCC) DD9.5(VCC) R6.2 R17.2 U1.3(IN) XP2.a1 XP2.b1 XP2.c1
GND: C2.2 C3.2 C4.2 C5.2 C6.2 C7.2 C8.2 C9.1 C10.2 C11.1 C12.2 C13.1 C14.2 C15.1 C16.2 C17.1 C19.1 C20.2 C21.1 C22.1 C23.1 C24.1 C27.2 C28.2 C29.2 C30.1 C31.1 C32.2 C36.2 C37.1 C38.1 C39.1 C40.1 C41.1 C42.1 C43.2 C44.2 C45.2 C46.2 C47.2 C48.2 DA1.2(GND) DD1.8(CPGND) DD1.9(AGND) DD1.11(AGNDVCO) DD1.18(AGNDVCO) DD1.21(AGNDVCO) DD1.27(DGND) DD1.31(SDGND) DD1.33(EP) DD2.5(GND) DD2.6(GND) DD3.2(GND) DD3.4(GND) DD4.17(EP) DD5.1(~{OE}) DD5.3(GND) DD6.1(~{OE}) DD6.3(GND) DD7.4(GND) DD8.1(~{OE}) DD8.3(GND) DD9.1(~{OE}) DD9.3(GND) LG1.2 LG1.4 LG1.6 LG1.8 R2.1 R5.2 R8.1 R9.2 R10.1 R11.1 R12.1 R15.1 U1.1(GND) U2.5(GND) XP2.a2 XP2.a4 XP2.a5 XP2.a16 XP2.b2 XP2.b4 XP2.b5 XP2.c2 XP2.c4 XP2.c5 XP2.MH XW1.2 XW2.2 ZQ1.3(Корпус)
CLK: DD1.1(CLK) DD4.8(SCK) XP2.a15
CS: DD4.9(SLE) XP2.a11
DATA: DD1.2(DATA) DD4.7(SDI) XP2.a13
DIV_N: DD4.10(~{DIVN}) U2.3(~{D})
DIV_P: DD4.11(DIVP) U2.2(D)
LD: DD1.25(LD) XP2.b16
LE: DD1.3(LE) XP2.a12
LED_1: R20.2 XP2.c6
LED_2: R19.2 XP2.c8
LED_3: R18.2 XP2.c10
REF_IN: C1.1 ZQ1.4(Выход_частоты)
RFOutA_N: DD1.13(RFOUTA−) DD2.3(Balanced_Port)
RFOutA_P: DD1.12(RFOUTA+) DD2.4(Balanced_Port)
RFOutB1_N: C34.2 DD4.2(OSCP)
RFOutB1_P: C33.2 DD4.3(~{OSCN})
RFOutB_N: C34.1 DD1.15(RFOUTB−) L4.1
RFOutB_P: C33.1 DD1.14(RFOUTB+) L3.1
SPI_MISO: DD1.30(MUXOUT) DD4.6(GPO) XP2.a14
SW: R1.1 R4.2 R5.1
SYNC: R14.2 XP2.a10
NetC1_2: C1.2 DD1.29(REFIN)
NetC2_1: C2.1 C3.1 DD1.19(TEMP)
NetC4_1: C4.1 C5.1 DD1.23(VCOM)
NetC6_1: C6.1 C7.1 DD1.24(VREF)
NetC18_1: C18.1 DD1.7(CPOUT) R3.1
NetC18_2: C18.2 R4.1
NetC19_2: C19.2 DD1.20(VTUNE) R3.2
NetC25_1: C25.1 DD2.1(Unbalanced)
NetC25_2: C25.2 DD3.1(RF_In)
NetC26_1: C26.1 DD3.3(RF_Out) L2.1
NetC26_2: C26.2 R7.1 R8.2
NetC27_1: C27.1 C28.1 L2.2 R6.1
NetC35_1: C35.1 C39.2 C40.2 DD4.12(VDD3_DECAP)
NetC35_2: C35.2 DD4.14(FB_DECAP)
NetC36_1: C36.1 DD4.15(BGAP_DECAP)
NetDD1_5: DD1.5(SW) R1.2
NetDD1_22: DD1.22(RSET) R2.2
NetDD2_2: DD2.2(GND/DC_Feed_+RF_GND) L1.1
NetDD4_1: DD4.1(CHIP0) R10.2
NetDD4_4: DD4.4(CHIP1) R11.2
NetDD4_5: DD4.5(CHIP2) R12.2
NetDD4_13: DD4.13(TRIG) R13.1 R14.1 R15.2
NetDD5_2: DD5.2(A) U2.7(Q)
NetDD5_4: DD5.4(Y) DD6.2(A)
NetDD6_4: DD6.4(Y) DD7.1(CP)
NetDD7_2: DD7.2(D) DD7.3(~{Q})
NetDD7_5: DD7.5(Q) DD8.2(A) DD9.2(A)
NetDD8_4: DD8.4(Y) R16.2 XW2.1
NetDD9_4: DD9.4(Y) R16.1
NetLG1_1: LG1.1 R17.1
NetLG1_3: LG1.3 R18.1
NetLG1_5: LG1.5 R19.1
NetLG1_7: LG1.7 R20.1
NetR7_2: R7.2 R9.1 XW1.1

Not connected (* = marked no-connect by the designer): U2 1(NC)* 4(VBB)* 6(NC)*; XP2 a3 a6 a7 a8 a9 b3 b6 b7 b8 b9 b10 b11 b12 b13 b14 b15 c3 c7 c9 c11 c12 c13 c14 c15 c16; ZQ1 1(N.C.)* 5(N.C.)*

### Layout directives
differential pair: DIV_N, DIV_P, RFOutA_N, RFOutA_P, RFOutB1_N, RFOutB1_P, RFOutB_N, RFOutB_P
net class 50_Om: DIV_N, DIV_P, NetDD4_13, NetDD5_2, NetDD5_4, NetDD6_4, NetDD7_5, NetDD8_4, NetR7_2, RFOutA_N, RFOutA_P, RFOutB_N, RFOutB_P, SYNC

### Notes on the sheet
- Возможно неправильно подвёл пины
- DWG NO:
- REV:
- THIS DOCUMENT AND THE DATA DISCLOSED HEREIN OR
- HEREWITH IS THE PROPERTY OF ALTIUM LIMITED AND MAY
- BE FREELY DISTRIBUTED IN WHOLE. NO RIGHTS ARE
- RESERVED OR EXPRESS OR IMPLIED WARANTEE GIVEN.
- REVISION
- DESCRIPTION
- DATE
- APPROVED
- ENG:
- APPROVALS
- PROJECT
- DSN:
- CHK:
- REFERENCE DOCUMENTS
- PROJECT REVISION:
- TITLE
- DOCUMENT REVISION:
- DESIGN ITEM:
- BOM:
- FAB DWG:
- PCB DWG:
- ASSY DWG:
- SCALE:
- A2
- SIZE
- CAGE CODE
- FILE NAME
- DWG NO.
- SHEET
- OF
- REV
- (in symbol 09 23 148 6921, part A) Цепь
- (in symbol 09 23 148 6921, part B) Цепь
- (in symbol 09 23 148 6921, part C) Цепь
- (in symbol 1296.1004) UP

### Library data of the parts
C1-C22 C29-C41 C44-C48 = Capacitors: Capacitor; Tolerance: ±10%; Category: Конденсаторы; Type: *
C23 C42 = VJ0805Y104KXBTW1BC: Ceramic Capacitor  0.1uF 100V; Manufacturer: Vishay Vitramon; Dielectric Material: Tantalum; Tolerance: 10%; Dielectric: X7R; Разработчик: Богатов Алексей; Supplier 1: Farnell; Stock 1: 0; Pricing 1: 5=0.0806, 50=0.0509, 250=0.0369, 500=0.0317 (RUB); Mount: Surface Mount; Case/Package: 0805; Min Operating Temperature: -55°C; Max Operating Temperature: 125°C; Packaging: Tape and Reel; Voltage Rating (DC): 100V; Length: 2mm; Depth: 1.25mm; Radiation Hardening: No; Lead Free: Lead Free; ComponentLink1URL: http://www.vishay.com/docs/28548/vjw1bcbascomseries.pdf; ComponentLink1Description: http://www.vishay.com/docs/28548/vjw1bcbascomseries.pdf; Supplier Part Number 1: 2896560; Manufacturer Part Number: VJ0805Y104KXBTW1BC; Category: Конденсаторы
C24 = VJ0805V106ZXQTW1BC: Ceramic Capacitors 10uF 10volts; Manufacturer: Vishay Vitramon; Dielectric Material: Tantalum; Tolerance: 80%; Dielectric: Y5V; Voltage Rating (DC): 10V; Разработчик: Богатов Алексей; Supplier 1: Digi-Key; Manufacturer Part Number: VJ0805V106ZXQTW1BC; Stock 1: 0; Pricing 1: 3000=0.1089 (USD); Mount: Surface Mount; Case/Package: 0805; Min Operating Temperature: -30°C; Max Operating Temperature: 85°C; Lead Free: Lead Free; ComponentLink1URL: http://www.vishay.com/docs/28548/vjw1bcbascomseries.pdf; ComponentLink1Description: http://www.vishay.com/docs/28548/vjw1bcbascomseries.pdf; Supplier Part Number 1: VJ0805V106ZXQTW1BC-ND; Category: Конденсаторы
C25-C27 = 100A101JT150XT: Multilayer Ceramic Capacitors MLCC; Manufacturer: American Technical Ceramics; Tolerance: ±5%; Разработчик: Леткин Д.С.; Voltage Rating (DC): 150V; Category: Конденсаторы; Manufacturer Part Number: 100A101JT150XT; RoHS: Yes; Case Code: 1414; Min Operating Temperature: -55°C; Max Operating Temperature: 125°C; Packaging: Tape and Reel; Termination: SMD/SMT; ComponentLink2URL: http://www.atceramics.com/UserFiles/100a.pdf?src-supplier=Digi-Key; ComponentLink2Description: datasheet; ComponentLink3Description: American Technical Ceramic Corp.; ComponentLink3URL: http://www.atceramics.com/Capacitors/3/Multilayer-Capacitors
C28 = VJ0603Y104KXAAC: Ceramic Capacitors 0.1uF 50volts; Manufacturer: Vishay Semiconductors; Tolerance: 10%; Dielectric: X7R; Voltage Rating (DC): 50V; Разработчик: Богатов Алексей; Supplier 1: Digi-Key; Manufacturer Part Number: VJ0603Y104KXAAC; Stock 1: 180000; Pricing 1: 4000=0.0861 (USD); Mount: Surface Mount; Case/Package: 0603; Min Operating Temperature: -55°C; Max Operating Temperature: 150°C; Packaging: Tape and Reel; Length: 1.6mm; Depth: 0.8mm; Radiation Hardening: No; Lead Free: Lead Free; Category: Конденсаторы; Supplier Part Number 1: 720-1848-2-ND
C43 = Capacitor Polarized: Tolerance: ±10%; Category: Конденсаторы; Type: *
DA1 = LF50ABDT-TR: IC REG LDO 5V 0.5A DPAK; Manufacturer: STMicroelectronics; Max Input Voltage: 16V; Polarity: Positive; Quiescent Current: 1mA; Accuracy: 1%; Output Type: Fixed; Dropout Voltage: 400mV; Output Current: 500mA; Min Input Voltage: 3V; Разработчик: Леткин Д.; Manufacturer Part Number: LF50ABDT-TR; Mount: Surface Mount; Case/Package: TO-252; Output Voltage: 5V; Nominal Output Voltage: 5V; Output Voltage Accuracy: 1%; ComponentLink1URL: http://www.st.com/content/ccc/resource/technical/document/datasheet/c4/0e/7e/2a/be/bc/4c/bd/CD00000546.pdf/files/CD00000546.pdf/jcr:content/translations/en.CD00000546.pdf; ComponentLink1Description: Datasheet; ComponentLink5URL: https://www.digikey.ca/product-detail/en/stmicroelectronics/LF50ABDT-TR/497-8344-1-ND/1958549; ComponentLink5Description: Digi-Key; Category: Микросхемы
DD1 = ADF4351BCPZ: Phase Locked Loops - PLL WB Synthesizer w/ Intg VCO; Manufacturer: Analog Devices; Min Supply Voltage: 3V; Operating Supply Voltage: 3.3V; Nominal Supply Current: 110mA; Max Frequency: 4.4GHz; Input: CMOS; PLL: Yes; Interface: SPI; Разработчик: Леткин Д.С.; ComponentLink1Description: datasheet; ComponentLink1URL: https://www.analog.com/media/en/technical-documentation/data-sheets/ADF4351.pdf; ComponentLink2Description: Mouser; ComponentLink2URL: https://ru.mouser.com/ProductDetail/Analog-Devices/ADF4351BCPZ?qs=BpaRKvA4VqFCiUOrGPcIQw%3D%3D; Case/Package: LFCSP-32; Min Operating Temperature: -40°C; Max Operating Temperature: 85°C; Frequency: 4.4GHz; Category: Микросхемы; Manufacturer Part Number: ADF4351BCPZ
DD2 = BD1631J50100AHF: The BD1631J50100AHF is a low profile sub-miniature balanced to unbalanced / transformer designed for differential inputs and output locations on next generation / wireless chipsets in an easy to use surface mount package covering 802.11b+g+n, / GSM, DCS, PCS and UMTS.; Manufacturer: Anaren; Impedance: 100R; Insertion Loss: 0.6dB; Frequency: 1.6 - 3.1GHz; Разработчик: Леткин Д.С.; Number of Pins: 6; Case Code (Imperial): 0805; Contact Plating: Gold; Min Operating Temperature: -55°C; Max Operating Temperature: 85°C; Category: Микросхемы; ComponentLink1Description: datasheet; ComponentLink1URL: https://cdn.anaren.com/product-documents/Xinger/BalunTransformers/BD1631J50100AHF/BD1631J50100AHF_DataSheet(Rev_K).pdf; ComponentLink2Description: Anaren; ComponentLink2URL: https://www.anaren.com/catalog/xinger/subminiature-components; Manufacturer Part Number: BD1631J50100AHF
DD3 = AG303-86G: The AG303-86 is a general-purpose buffer amplifier that / offers high dynamic range in a low-cost surface-mount / package.; Manufacturer: TriQuint; Operating Supply Voltage: 4.2V; Operating Supply Current: 35mA; Test Frequency: 900MHz; Gain: 20.5dB; Max Supply Voltage: 4.5V; Разрабочик: Леткин Д.С.; ComponentLink1Description: Datasheet; ComponentLink1URL: https://ru.mouser.com/datasheet/2/412/G303-86-1500726.pdf; ComponentLink2Description: Qorvo; ComponentLink2URL: https://www.qorvo.com/products/p/AG303-86G; Manufacturer Part Number: AG303-86G; Case/Package: SOT-86; Number of Pins: 4; Max Operating Temperature: 85°C; Packaging: Tape and Reel; Radiation Hardening: No; Category: Микросхемы
DD4 = HMC988LP3E: The HMC988LP3E is a an ultra low noise clock / divider capable of dividing by 1/2/4/8/16/32. It is a / versatile device with additional functionality including adjustable output phase, adjustable delay in 60 steps of ~ 20 ps, a clock synchronization function, and a clock invert option.; Manufacturer: Analog Devices; Max Frequency: 4GHz; Разработчик: Жабин И.; Operating Supply Voltage: +3.3V; Category: Микросхемы; Case/Package: QFN16; Manufacturer Part Number: HMC988LP3E; Max Operating Temperature: 85°C; Min Operating Temperature: -40°C
DD5 DD6 DD8 DD9 = SN74AHCT1G125DBVR: SINGLE BUS BUFFER GATE WITH 3-STATE OUTPUT; Manufacturer: Texas Instruments; Logic Type: Buffer, Non-Inverting; Number of Bits per Element: 1; Output Type: Push-Pull; Current - Output High, Low: 8mA, 8mA; Voltage - Supply: 4.5 V ~ 5.5 V; Supplier 1: Digi-Key; RoHS: RoHS Compliant; Category: Микросхемы; Stock 1: 30000; Pricing 1: 3000=0.0918, 6000=0.0867, 15000=0.07905 (USD); Packaging: Tape & Reel (TR); Part Status: Active; Input Type: -; Operating Temperature: -40°C ~ 125°C (TA); Mounting Type: Surface Mount; Package / Case: SC-74A, SOT-753; Supplier Device Package: SOT-23-5; Base Part Number: 74AHCT1G125; ComponentLink1URL: http://www.ti.com/lit/ds/symlink/sn74ahct1g125.pdf; ComponentLink1Description: Datasheet; Supplier Part Number 1: 296-4708-2-ND; Manufacturer Part Number: SN74AHCT1G125DBVR
DD7 = 74AUP1G74: Low-power D-type flip-flop with set and reset; positive-edge / trigger; Manufacturer: NXP Semiconductors; Max frequency: 315MHz; Разработчик: Жабин И.; Manufacturer Part Number: 74AUP1G74; Case/Package: SOT765-1; Number of Pins: 8; Logic Function: D-type flip-flop; Category: Микросхемы; ComponentLink1Description: Datasheet; ComponentLink1URL: http://www.farnell.com/datasheets/2174330.pdf
L1-L4 = 0603HP-18NXJE: Ceramic Chip Inductors; Manufacturer: Coilcraft; Разработчик: Леткин Д.С.; Category: Катушки индуктивности; ComponentLink1Description: datasheet; ComponentLink1URL: https://www.coilcraft.com/pdfs/0603hp.pdf; ComponentLink2Description: Coilcraft; ComponentLink2URL: https://www.coilcraft.com/0603hp.cfm; Manufacturer Part Number: 0603HP-18NXJE
LG1 = 1296.1004: световод на плату под 4 светодиода; Manufacturer: Mentor; Recomended diameter (front panel): 2mm; Value: APT1608ZGCK, APT1608ZGCK, APT1608ZGCK, APT1608ZGCK; Rule: UNIONINDEX=0|RULEKIND=PolygonConnect|NETSCOPE=AnyNet|LAYERKIND=SameLayer|NAME=Schematic Polygon Connect Style|CONNECTSTYLE=Relief|RELIEFCONDUCTORWIDTH=9.8425mil|RELIEFENTRIES=4|POLYGONRELIEFANGLE=90 Angle|AIRGAPWIDTH=9.8425mil|UNIT=Metric; Category: Прочее; ComponentLink1URL: https://www.mentor-bauelemente.de/en/products/product_search/?s=1296.1004&quelle=pds&k=#starts; Manufacturer Part Number: 1296.1004; Recomended LEDs Case: SMD 0603; ComponentLink1Description: Datasheet; ComponentLink1URL: *
R1 R5 = Resistors: Category: Резисторы; Type: *; Tolerance: *
R2-R4 = 0603R-4K7: GENERIC RESISTOR 0603; Manufacturer: Stackpole Electronics Inc; Manufacturer Part Number: RMCF 1/16 4.7K 1% R; Reel: R23; Supplier 1: Digi-Key; Supplier Part Number 1: RMCF0603FT4K70TR-ND
R6-R9 = 0603R-100: GENERIC RESISTOR 0603; Manufacturer Part Number: RMCF 1/16 100 1% R; Manufacturer: Stackpole Electronics Inc; Reel: R24; Supplier 1: Digi-Key; Supplier Part Number 1: RMCF1/16100FRDKR-ND
R10-R20 = 0603R-0R: GENERIC JUMPER 0603; Manufacturer: Stackpole Electronics Inc; Manufacturer Part Number: RMC 1/16 0 G; Reel: R26; Supplier 1: Digi-Key; Supplier Part Number 1: RMCF0603ZT0R00TR-ND
U1 = LD1117S50TR: Manufacturer: STMicroelectronics; Output Configuration: Positive; Output Type: Fixed; Voltage - Input (Max): 15V; Voltage - Output (Min/Fixed): 5V; Voltage Dropout (Max): 1.2V @ 800mA; Current - Output: 800mA; PSRR: 75dB (120Hz); Protection Features: Over Current, Over Temperature; Supplier 1: Digi-Key; Manufacturer Part Number: LD1117S50TR; RoHS: RoHS Compliant; Category: Integrated Circuits (ICs); Stock 1: 3876; Pricing 1: 1=0.51, 10=0.411, 100=0.2802, 500=0.21012, 1000=0.15759 (USD); Packaging: Cut Tape (CT); Part Status: Active; Voltage - Output (Max): -; Control Features: -; Operating Temperature: 0°C ~ 125°C; Mounting Type: Surface Mount; Package / Case: TO-261-4, TO-261AA; Supplier Device Package: SOT-223; Base Part Number: LD1117; ComponentLink1URL: http://www.st.com/content/ccc/resource/technical/document/datasheet/99/3b/7d/91/91/51/4b/be/CD00000544.pdf/files/CD00000544.pdf/jcr:content/translations/en.CD00000544.pdf; ComponentLink1Description: http://www.st.com/content/ccc/resource/technical/document/datasheet/99/3b/7d/91/91/51/4b/be/CD00000544.pdf/files/CD00000544.pdf/jcr:content/translations/en.CD00000544.pdf; Supplier Part Number 1: 497-6447-1-ND
U2 = SN65ELT21D: 400 Mbps 5 V PECL to TTL Translator with PECL Input and TTL Output, 1 Tx and 1 Rx, -40 to +85 degC, 8-pin SOIC (D), Green (RoHS & no Sb/Br); Manufacturer: Texas Instruments; ICC(Max)(mA): 20; No. of Rx: 1; Signaling Rate(Mbps): 400; SubFamily: PECL PHY; xECL: TRUE; DatasheetVersion: SLLS923; PackageVersion: revE, May-2006; PackageReference: DGK8; PackageDescription: 8-Pin Thin Small Outline Package 3 x 3 mm Body ,0.65 mm Pitch; Supplier 1: Digi-Key; Supplier Part Number 1: 296-24661-5-ND; Supplier 2: Farnell; Supplier Part Number 2: 1779981; Supplier 3: Newark; Supplier Part Number 3: 14R9900; Supplier 4: Mouser; Supplier Part Number 4: 595-SN65ELT21D; Eco-Plan: Green (RoHS & no Sb/Br); Input Signal: PECL; No. of Tx: 1; Output Signal: TTL; Mounting Technology: Surface Mount; Code_JEDEC: MO-187-AA; PartNumber: SN65ELT21D; ComponentLink1Description: Datasheet; ComponentLink1URL: http://www.ti.com/general/docs/lit/getliterature.tsp?genericPartNumber=SN65ELT21&fileType=pdf; ComponentLink2Description: URL Link1; ComponentLink2URL: SamplesURL:http://www.ti.com/product/sn65elt21#samples
XP2 = 09 23 148 6921: DIN-Signal 2C048MS-1C1-2; Manufacturer: HARTING; Packaging size: 20; Connector Type: Header, Male Pins; Number of Positions Loaded: All; Pitch: 0.100" (2.54mm); Style: C; Material Flammability Rating: UL94 V-0; Material - Insulation: Thermoplastic resin, Glass-fibre Filled; Function: просто так; Разработчик: Леткин Д.; Number of Contacts: 48; Manufacturer Part Number: 09231486921; RoHS: RoHS Compliant; Category: Разъёмы; Part Status: Active; Mounting Type: Through Hole, Right Angle; Termination: Solder; Features: -; Contact Finish: -; Contact Finish Thickness: -; Operating Temperature: -; Current Rating: -; ComponentLink1URL: https://b2b.harting.com/files/download/PRD/PDF_DS/09031200201_100580147DRW000B.pdf; ComponentLink1Description: Datasheet; HelpURL: https://b2b.harting.com/ebusiness/en_us/DIN-Signal-2C048MS-1C1-2/09231486921; Packaging: Bulk
XW1 XW2 = J01151A0201: Telegartner Right Angle 50Ohm Thru Hole SMA Connector,  jack,  Solder Termination; Supplier 1: Allied; RoHS: No; Stock 1: 509; Pricing 1: 1=11.2500 (USD); ComponentLink1URL: https://www.alliedelec.com/m/d/98f426e0d5bb6ee5532bde4cab502770.pdf; ComponentLink1Description: https://www.alliedelec.com/m/d/98f426e0d5bb6ee5532bde4cab502770.pdf; ComponentLink2URL: https://www.alliedelec.com/-j01151a0201/70884022/; ComponentLink2Description: https://www.alliedelec.com/-j01151a0201/70884022/; Supplier Part Number 1: 70884022; Category: Разъёмы; Manufacturer: Telegartner; Manufacturer Part Number: J01151A0201
ZQ1 = ГК1010-TK: Генераторы кварцевые программируемые; Manufacturer: БМГ ПЛЮС; Разработчик: Леткин Д.С.; Питание,В: 3.3; Джиттер, пс: 0,8; Частота, МГц: 10 - 250; Потребляемый ток, мA: 35; Нагрузка, пФ: 15; ComponentLink1Description: datasheet; ComponentLink1URL: http://bmgplus.ru/images/pdf/pdf1010_tcxo.pdf; Case/Package: DIL 8; Category: Фильтры; Manufacturer Part Number: ГК1010-TK